# EasyEDA Pro project ProDoc_XC7K35T_GTP_USB_Core_LiteRevB.1.brd_2025-10-08.epro, schematic XC7K35T_GTP_USB_Core_LiteRevB.1.sch

## Sheets
1 FPGA CONFIG: Board Name: XC7K35T_GTP_USB_Core_LiteRevB.brd_1; Create Date: 2025-09-28; Page Name: FPGA CONFIG; Project Name: XC7A35TCSG325_USB3_Demo; Schematic Name: XC7K35T_GTP_USB_Core_LiteRevB.sch_2; Update Date: 2025-09-28; Company: Xxx Studio; Drawed: A.W.2666; Page Size: A3; Reviewed: A.W.2666; Version: Rev.A.0
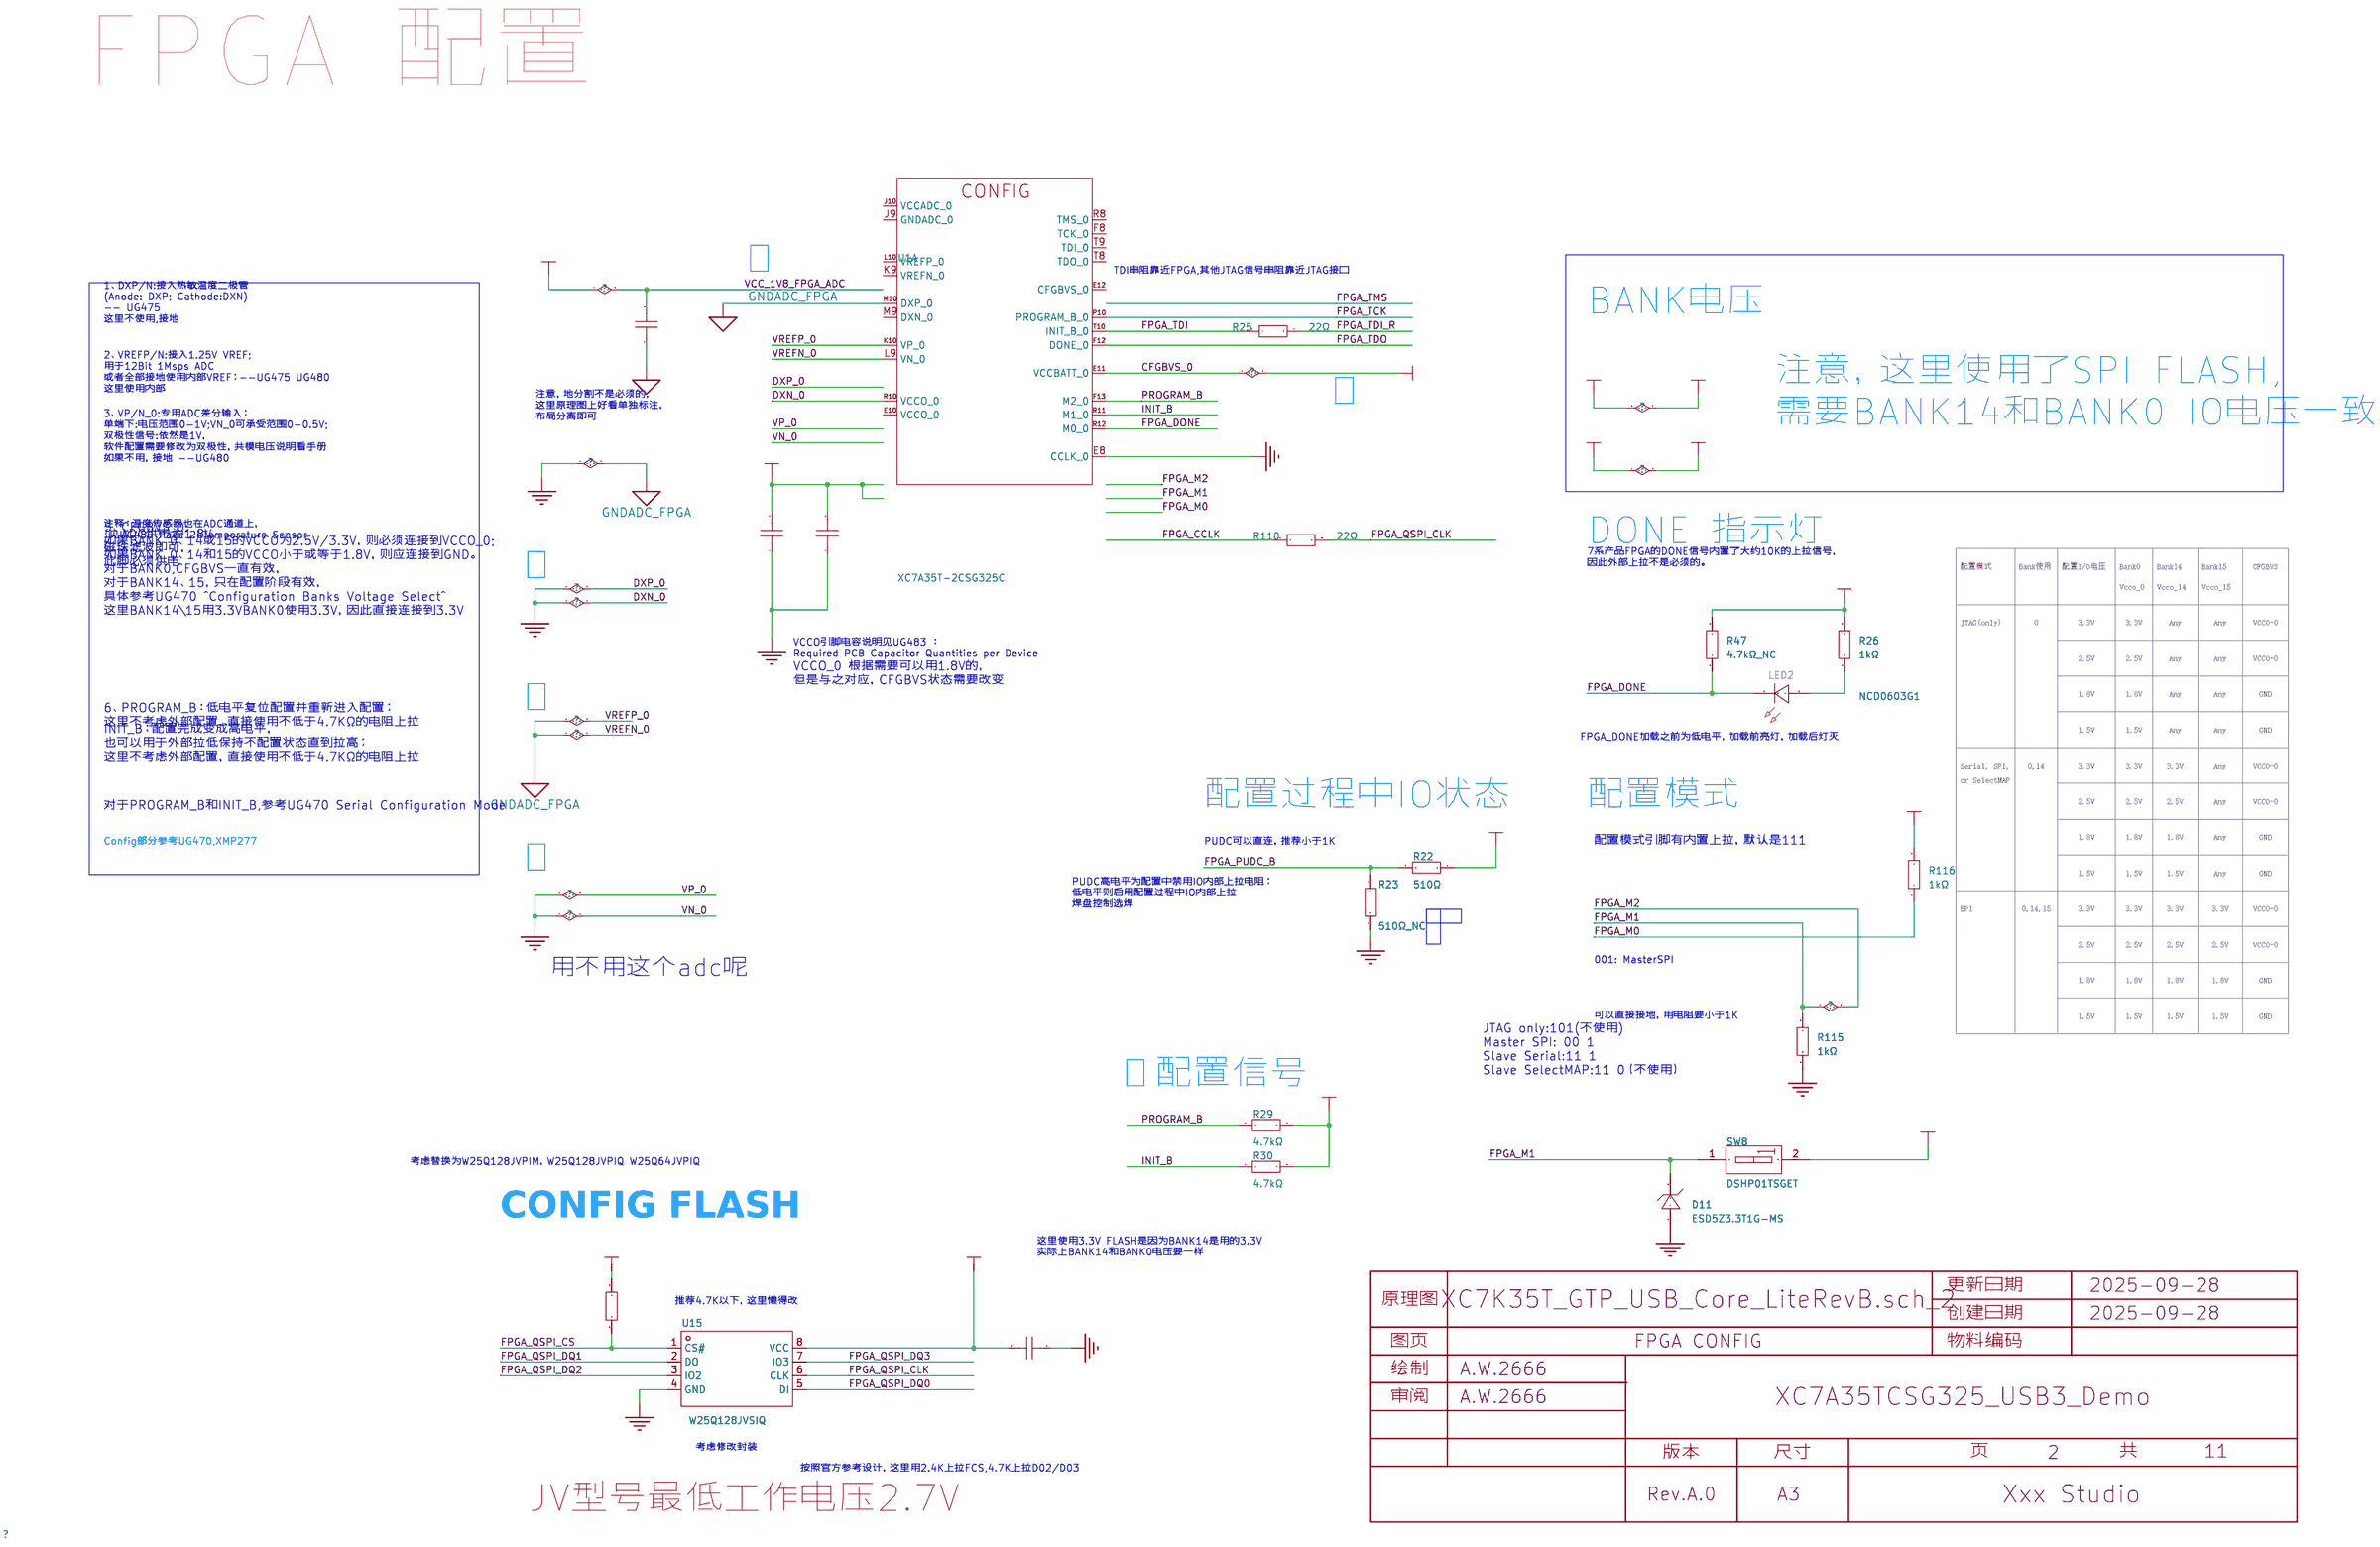
[diagram p0: FPGA CONFIG]
2 BANK14_15_BANK34: Board Name: XC7K35T_GTP_USB_Core_LiteRevB.brd; Create Date: 2025-09-08; Page Name: BANK14_15_BANK34; Schematic Name: XC7K35T_GTP_USB_Core_LiteRevB.sch; Update Date: 2025-09-08
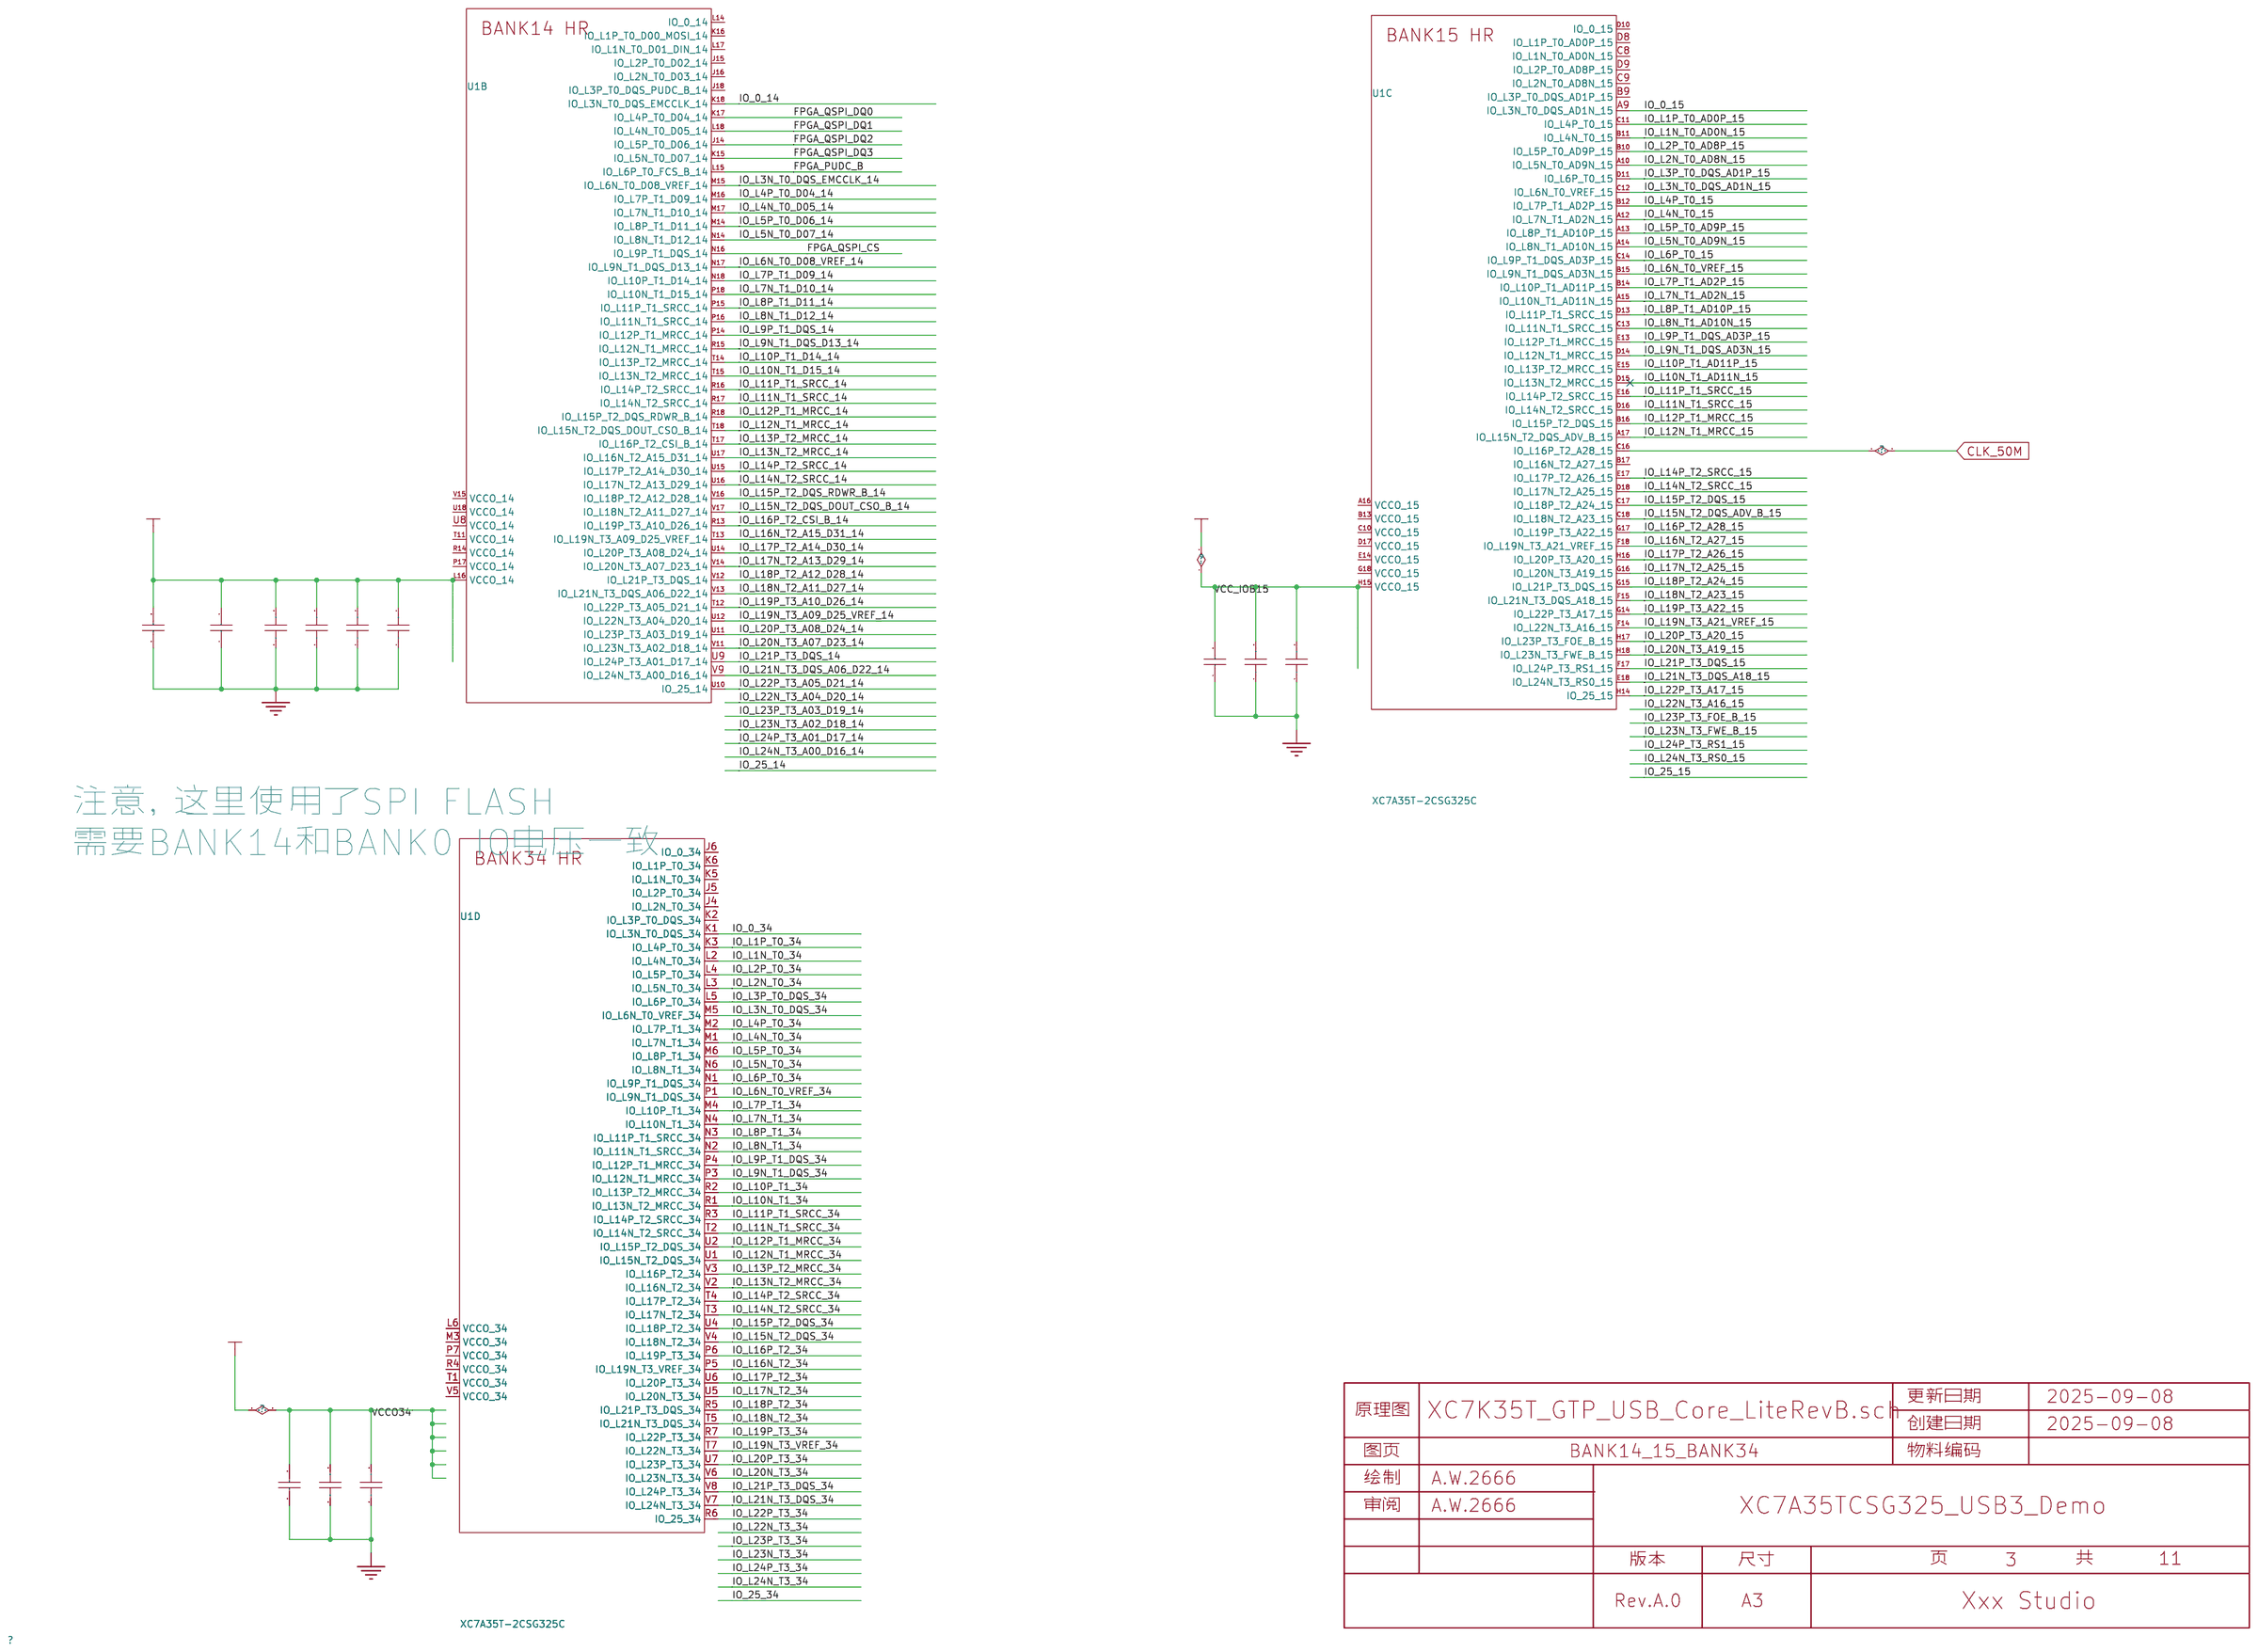
[diagram p1: BANK14_15_BANK34]
3 FPGA POWER: Board Name: XC7K35T_GTP_USB_Core_LiteRevB.brd; Create Date: 2025-09-08; Page Name: FPGA POWER; Schematic Name: XC7K35T_GTP_USB_Core_LiteRevB.sch; Update Date: 2025-09-08
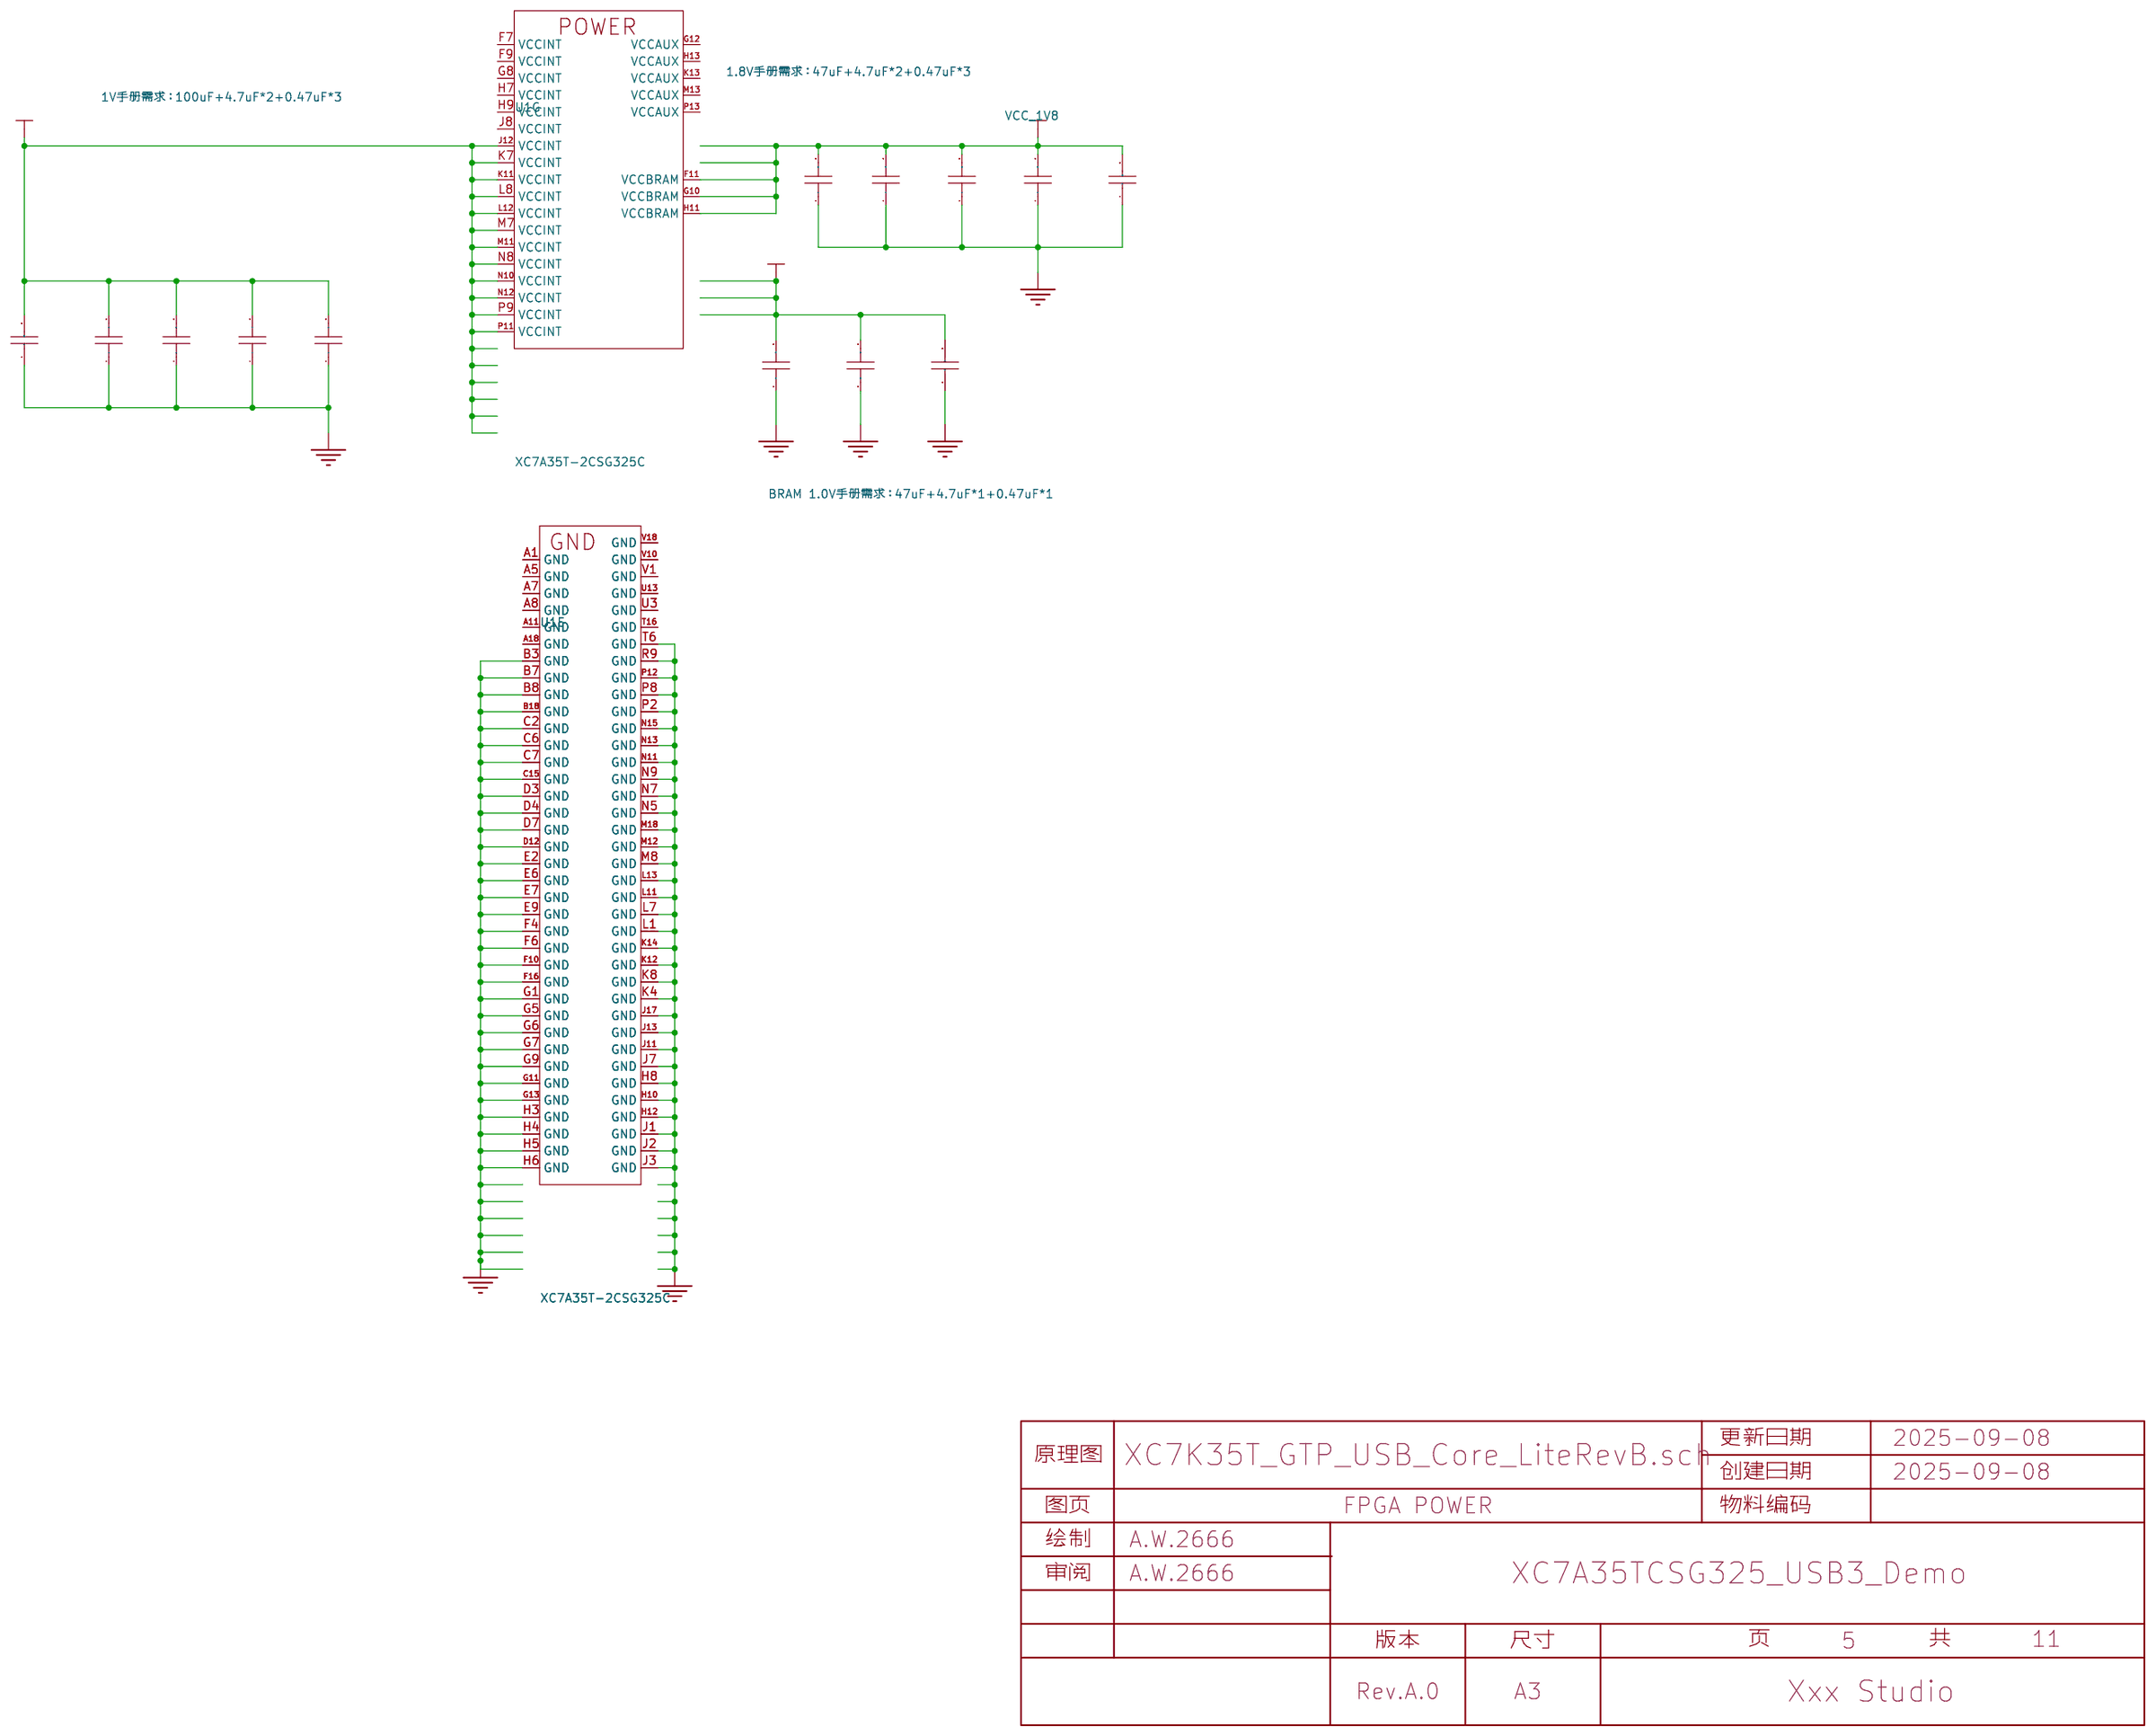
[diagram p2: FPGA POWER]
4 FPGA GTP: Board Name: XC7K35T_GTP_USB_Core_LiteRevB.brd; Create Date: 2025-09-08; Page Name: FPGA GTP; Schematic Name: XC7K35T_GTP_USB_Core_LiteRevB.sch; Update Date: 2025-09-08
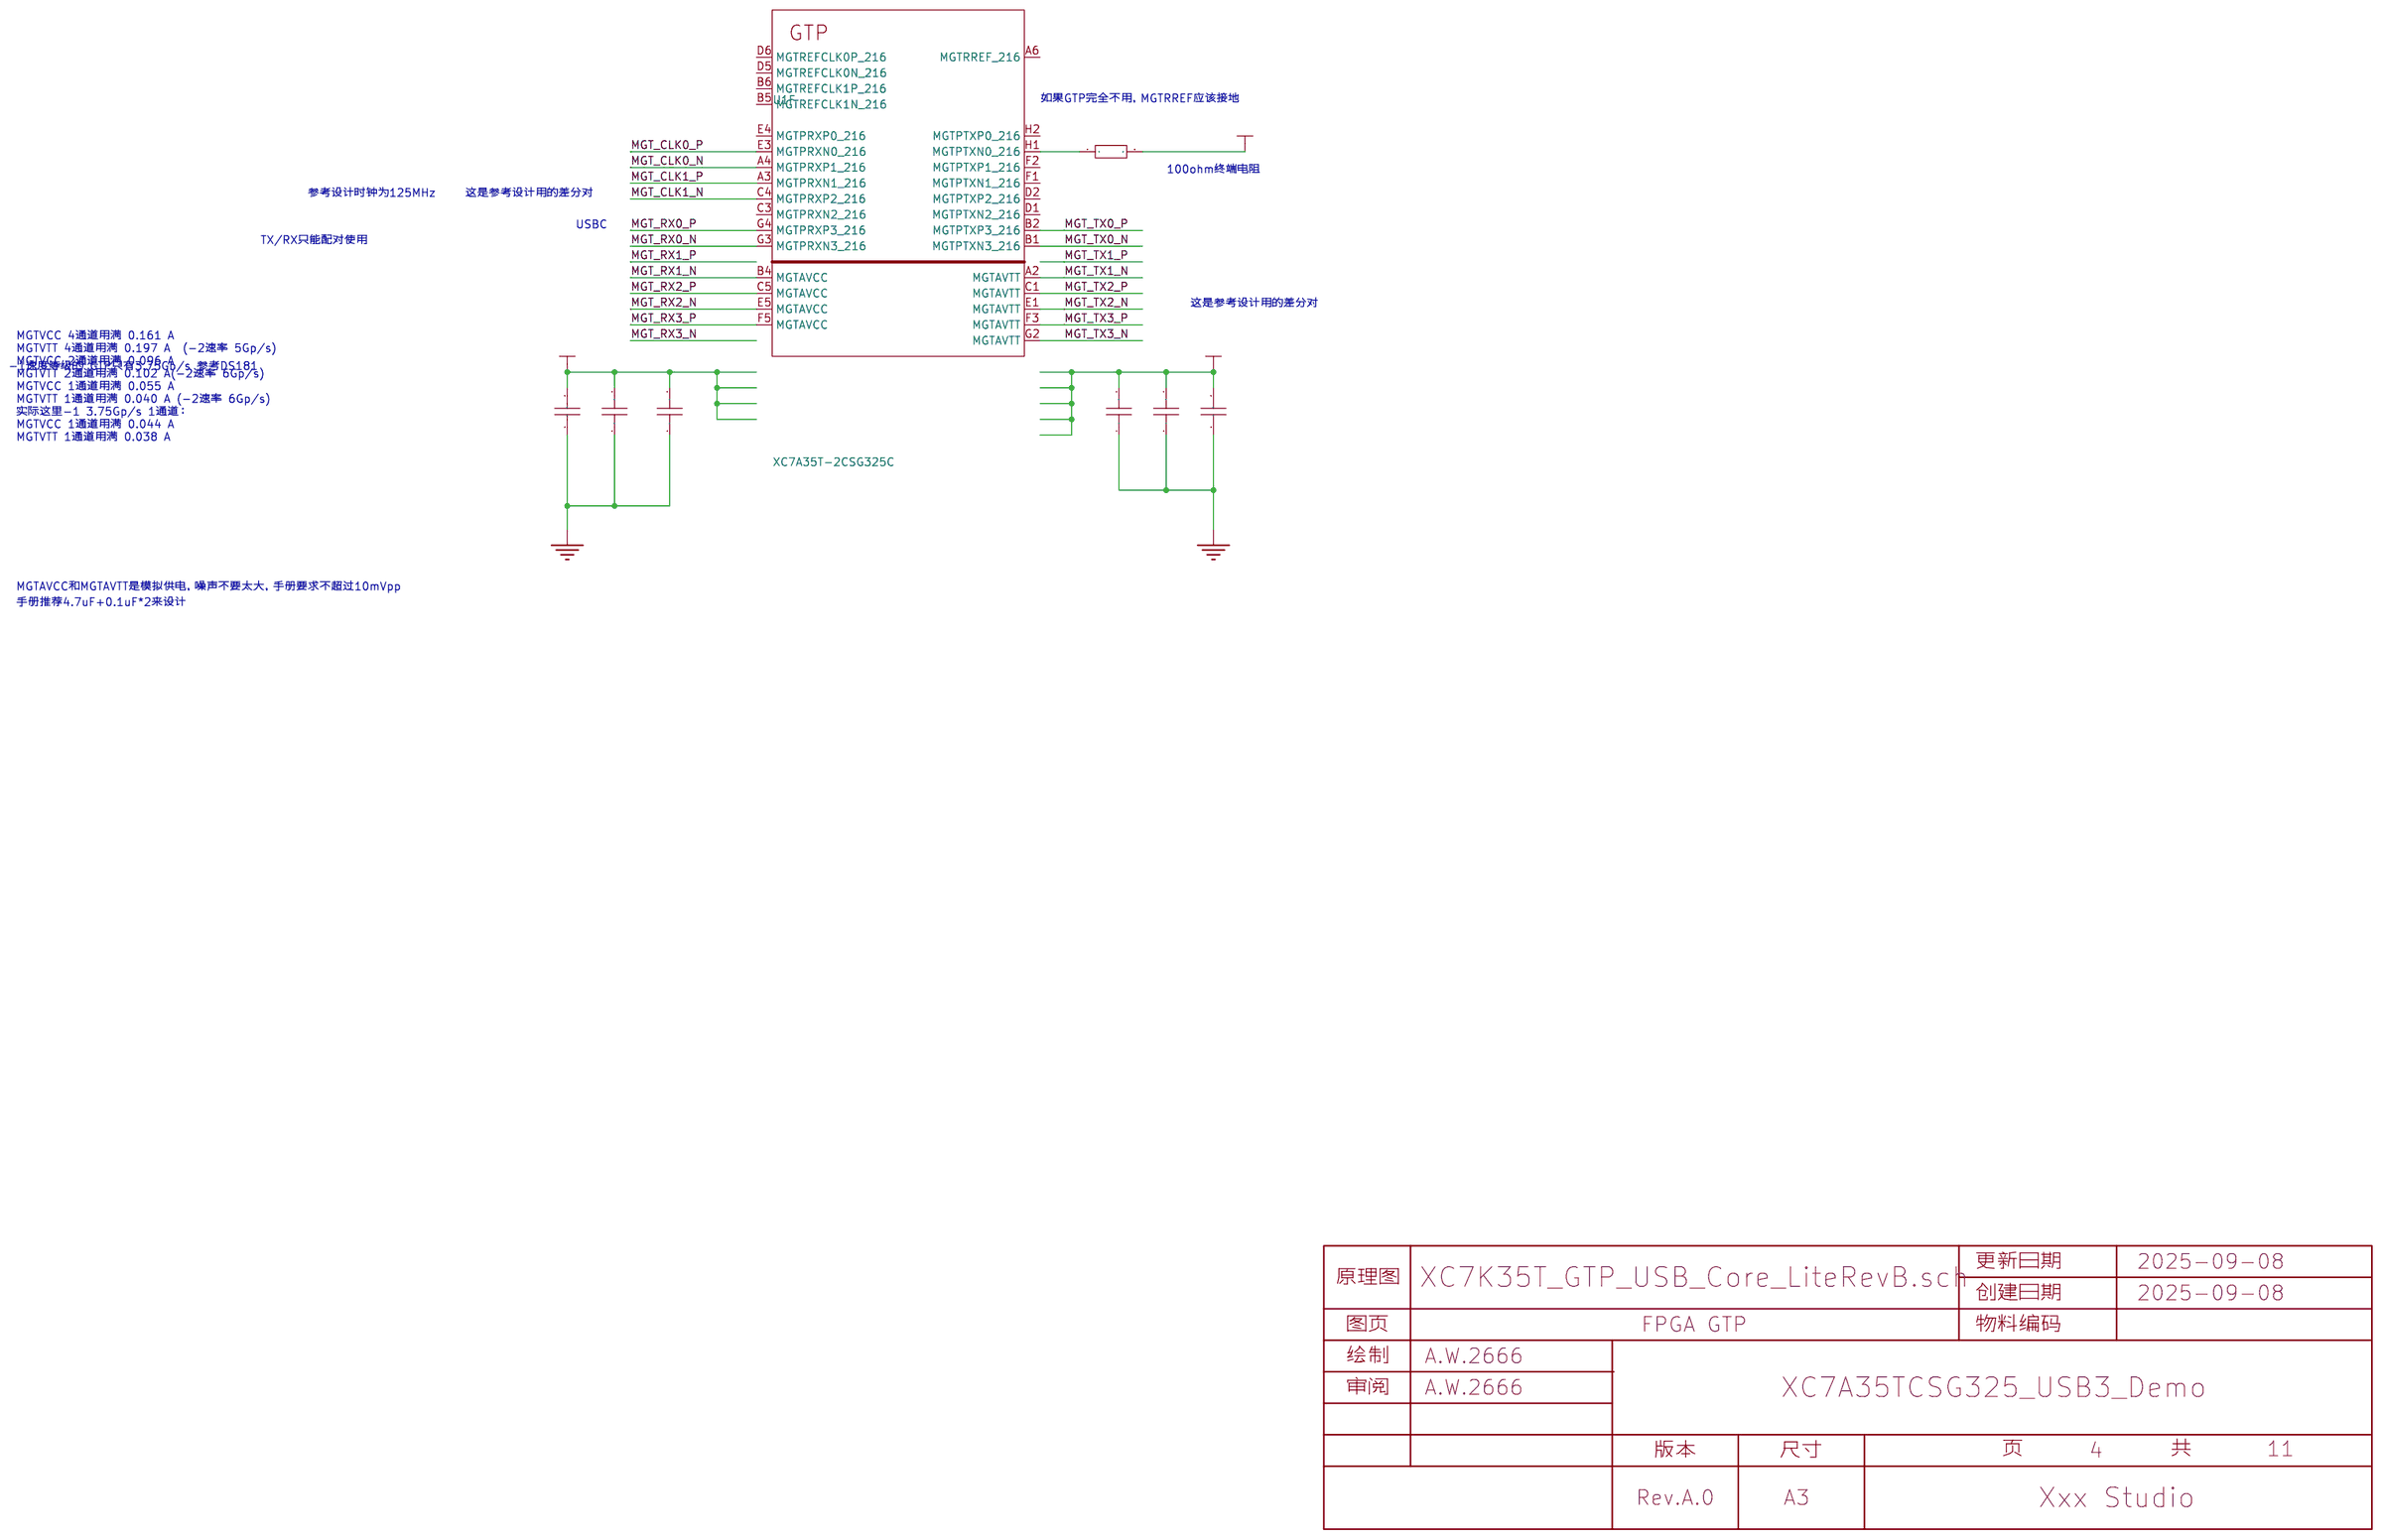
[diagram p3: FPGA GTP]
5 USB&BTB: Board Name: XC7K35T_GTP_USB_Core_LiteRevB.1.brd; Page Name: USB&BTB; Schematic Name: XC7K35T_GTP_USB_Core_LiteRevB.1.sch; Update Date: 2025-10-05
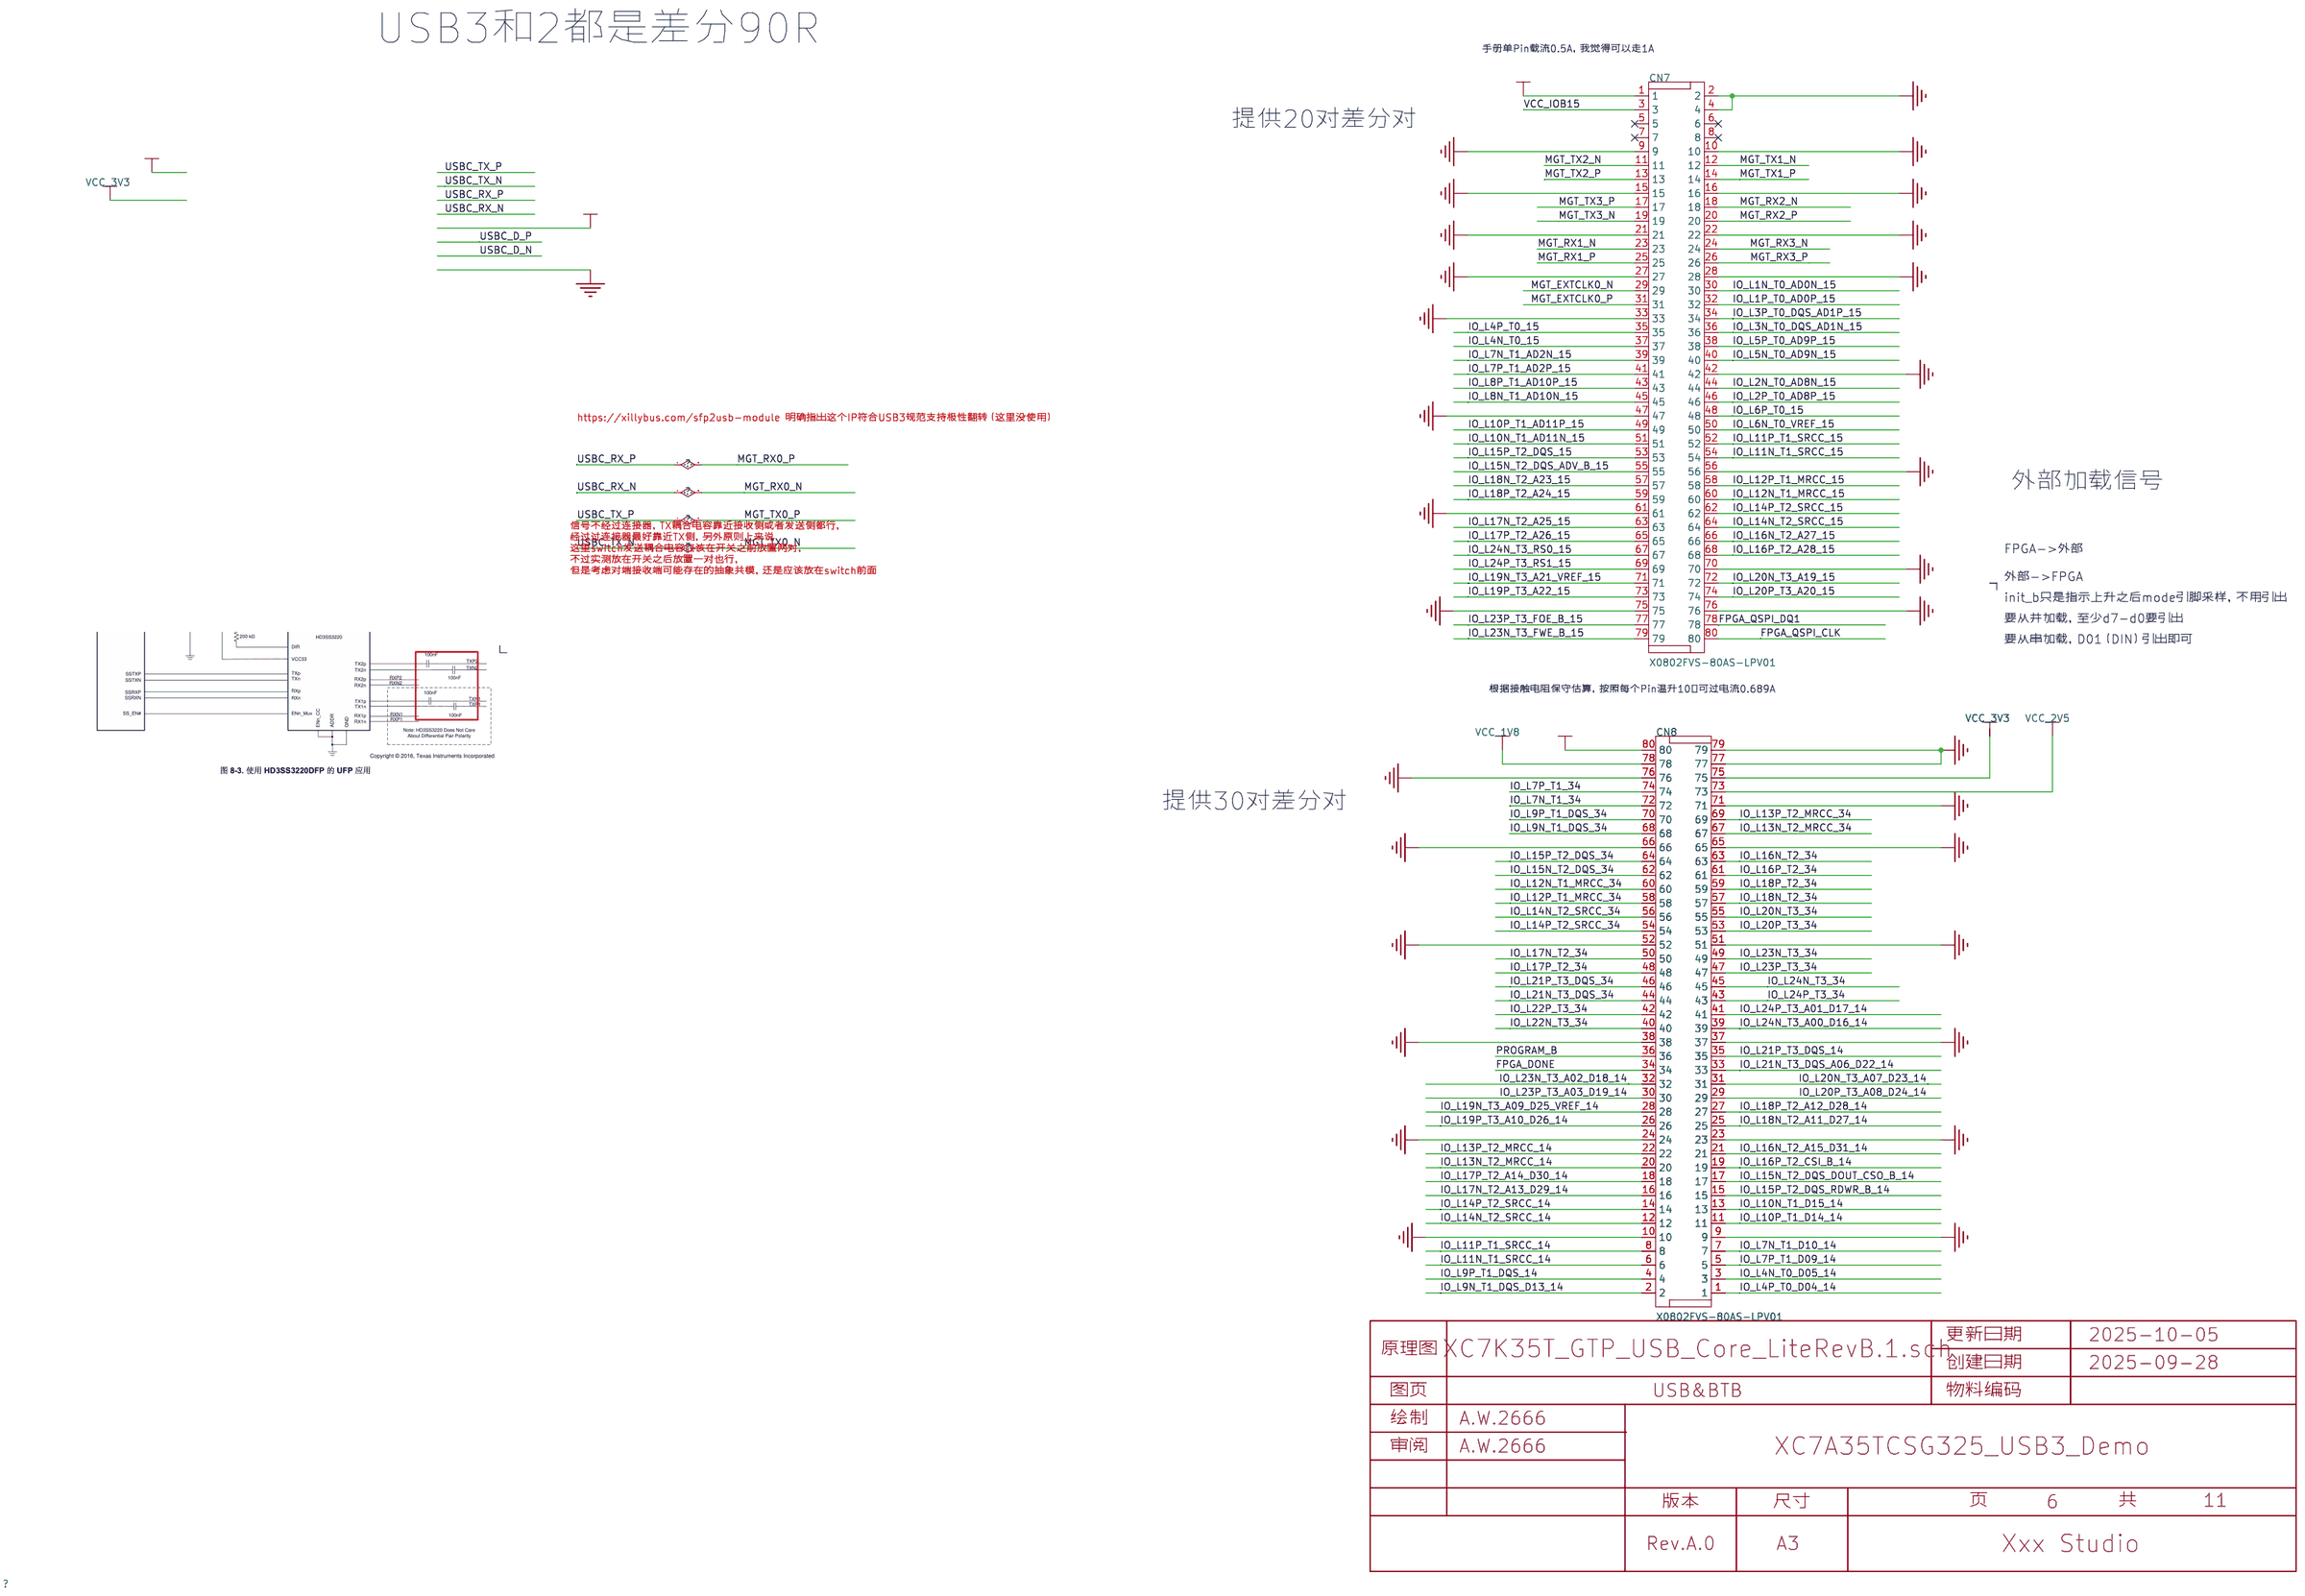
[diagram p4: USB&BTB]
6 CLOCK: Board Name: XC7K35T_GTP_USB_Core_LiteRevB.brd; Create Date: 2025-09-08; Page Name: CLOCK; Schematic Name: XC7K35T_GTP_USB_Core_LiteRevB.sch; Update Date: 2025-09-10
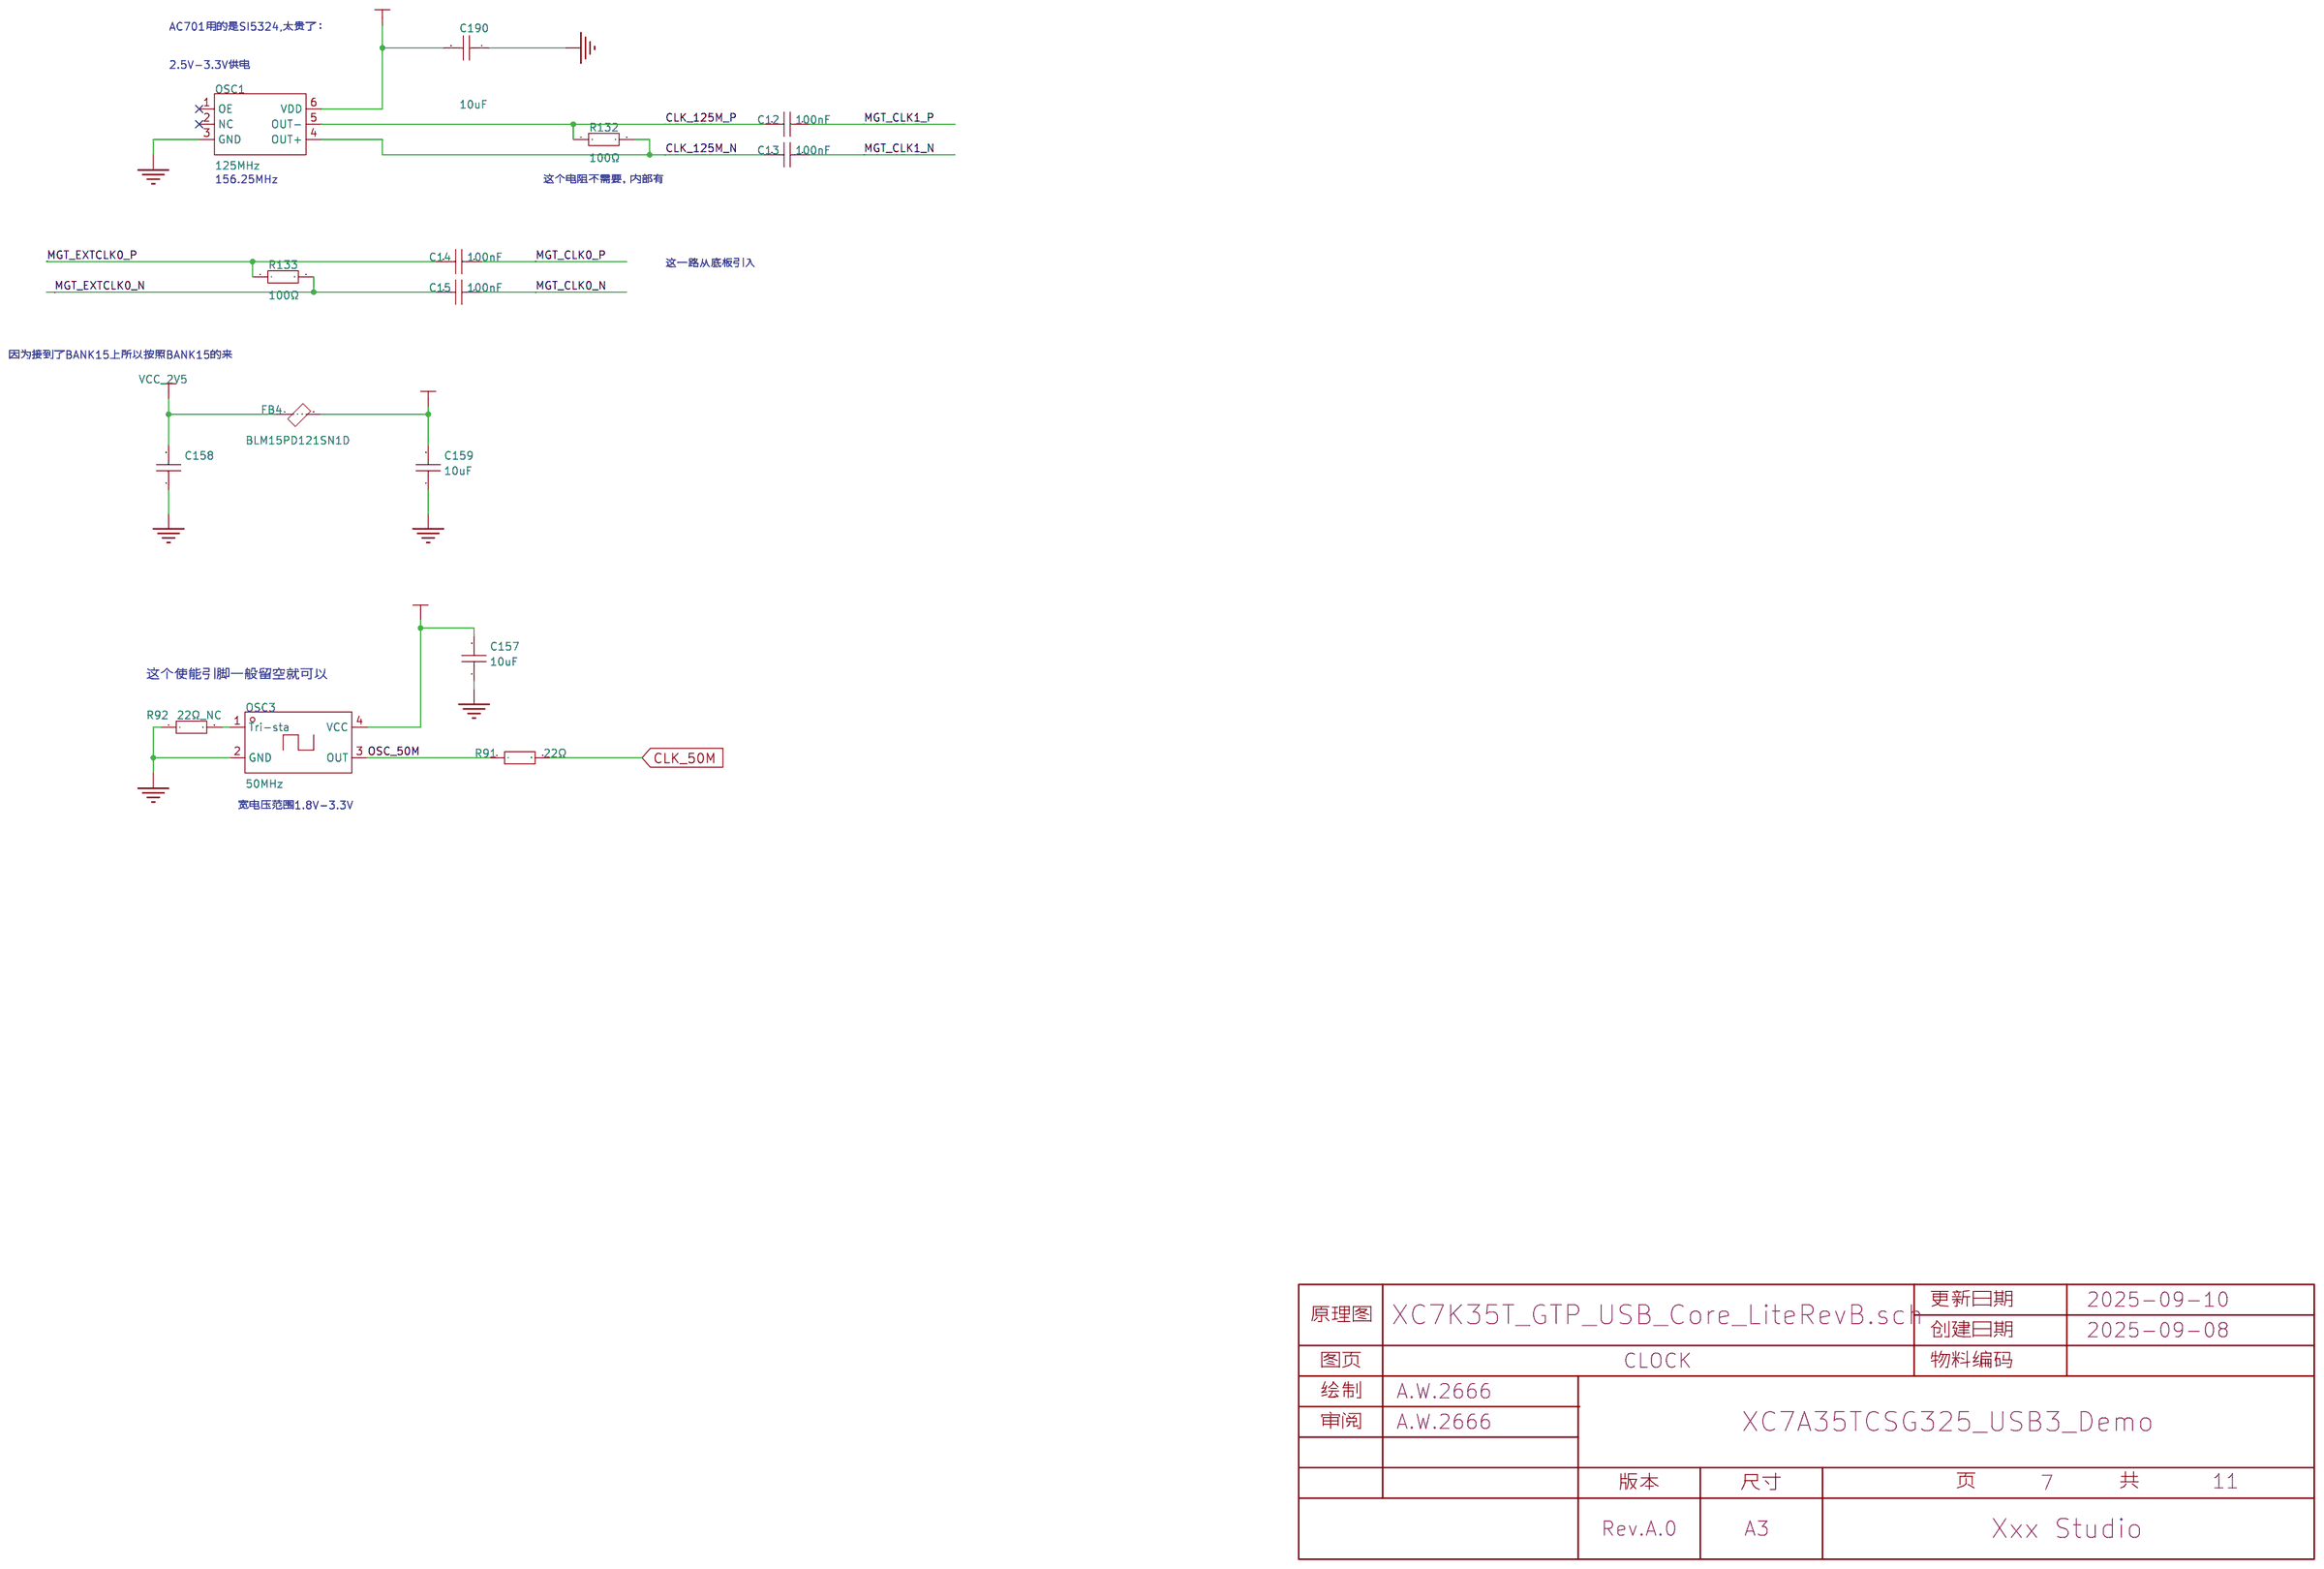
[diagram p5: CLOCK]
7 封面: Board Name: XC7K35T_GTP_USB_Core_LiteRevB.1.brd; Page Name: 封面; Schematic Name: XC7K35T_GTP_USB_Core_LiteRevB.1.sch
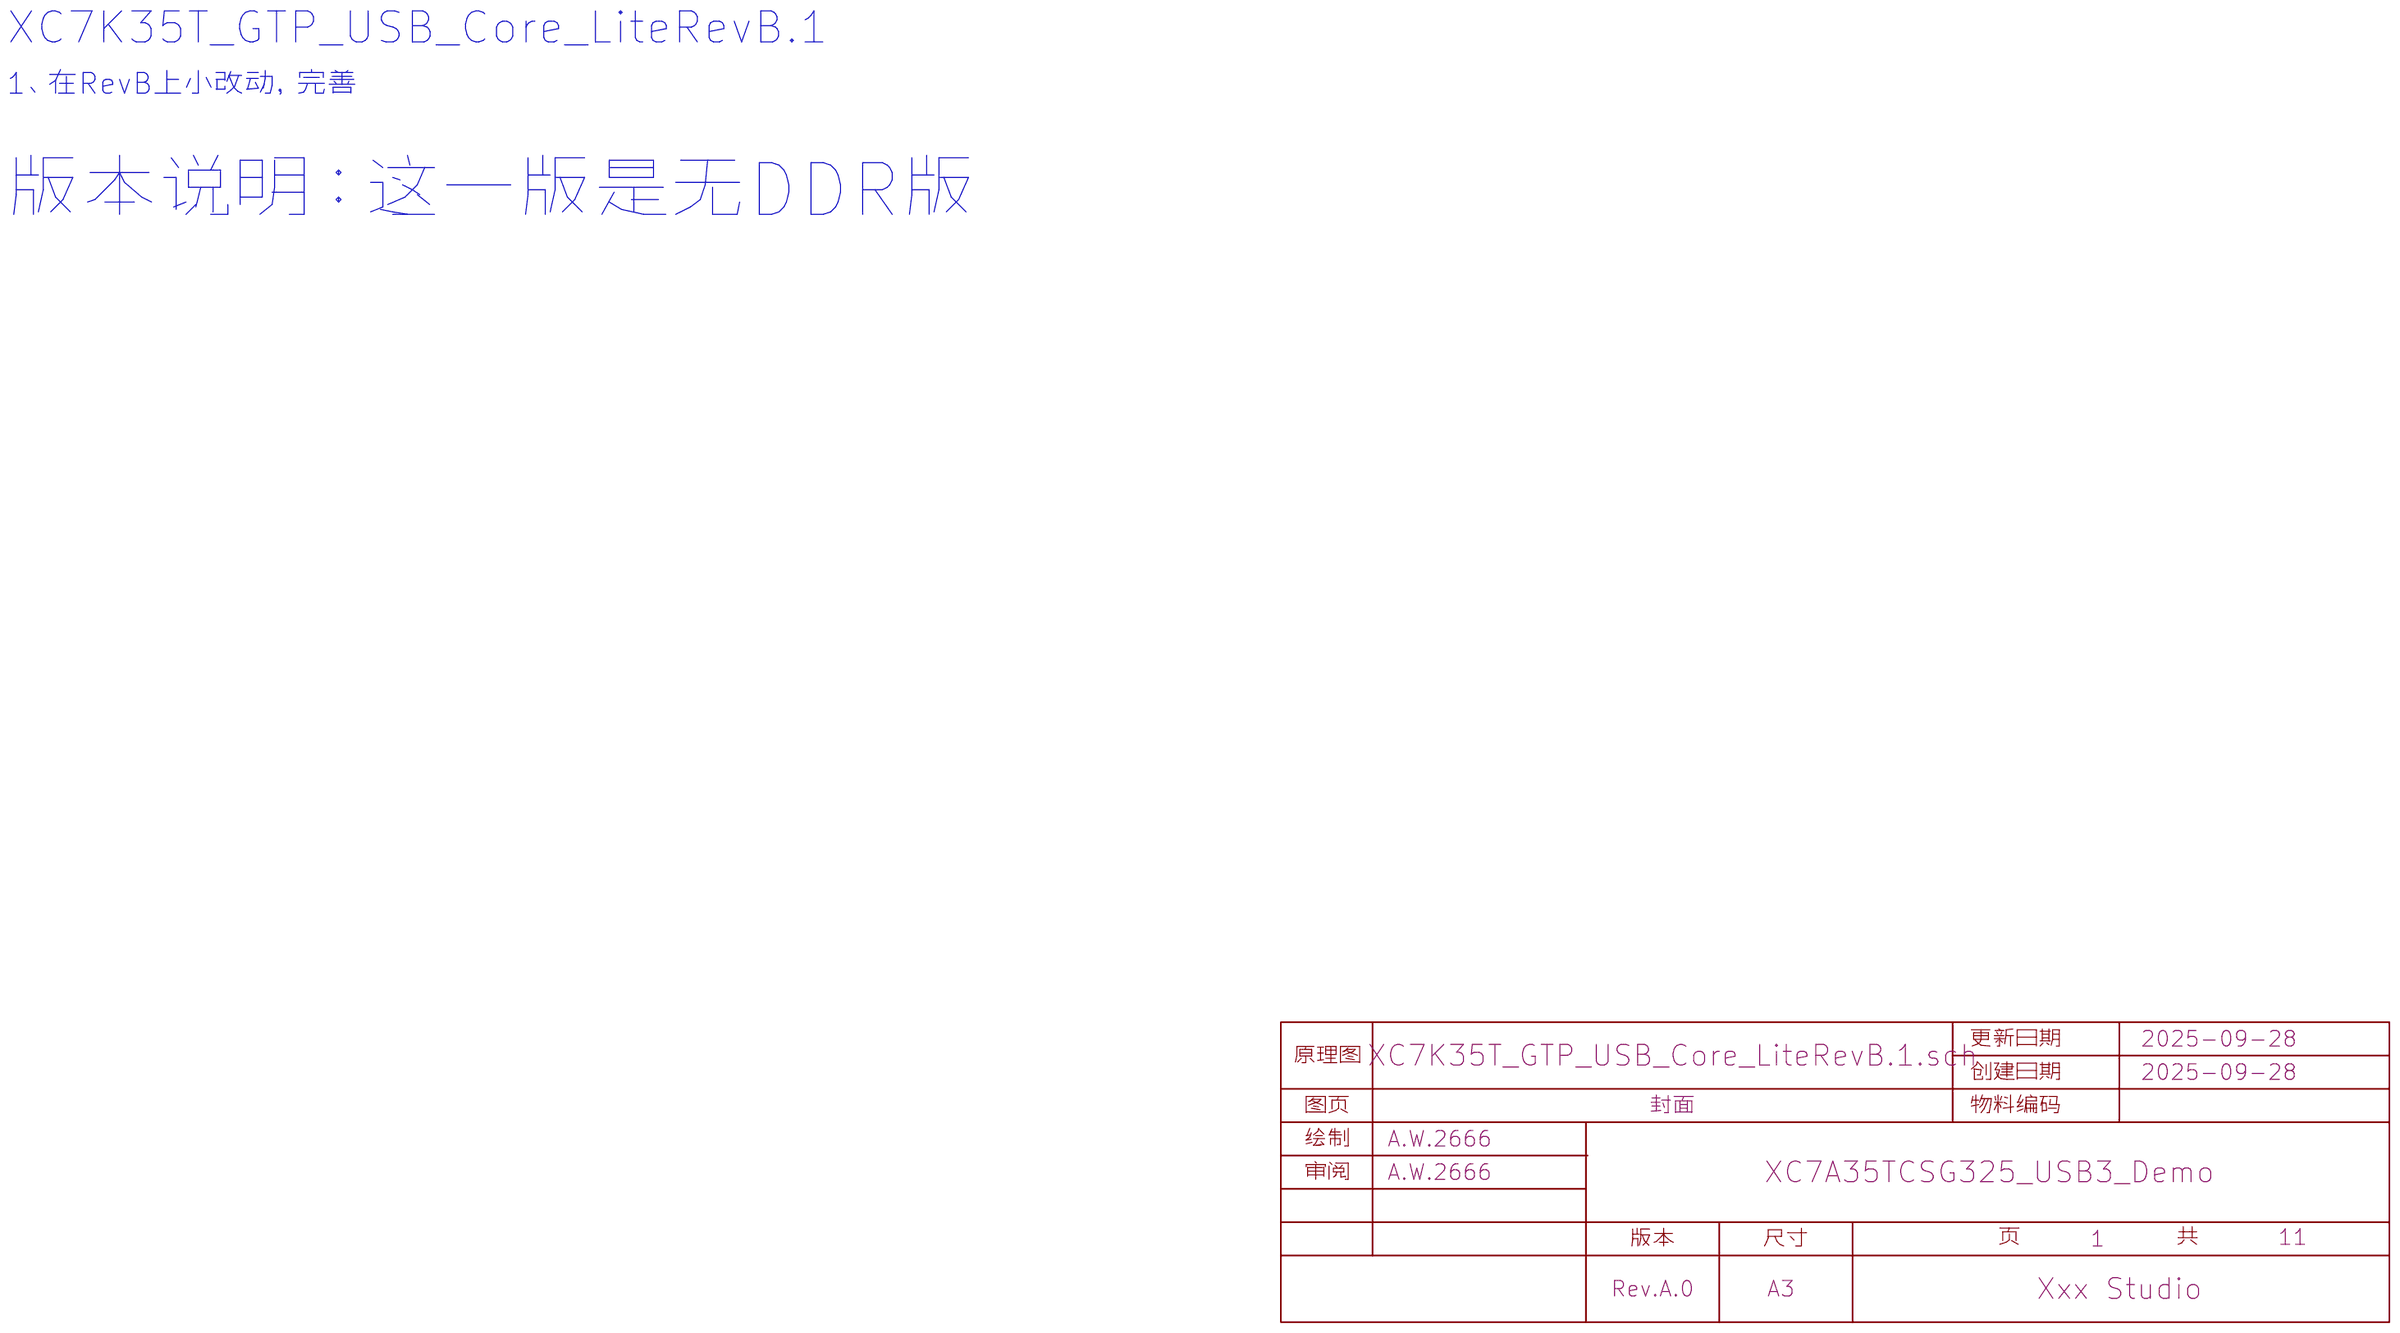
[diagram p6: 封面]
8 Mech&Conn: Board Name: XC7K35T_GTP_USB_Core_LiteRevB.1.brd; Page Name: Mech&Conn; Schematic Name: XC7K35T_GTP_USB_Core_LiteRevB.1.sch; Update Date: 2025-10-05
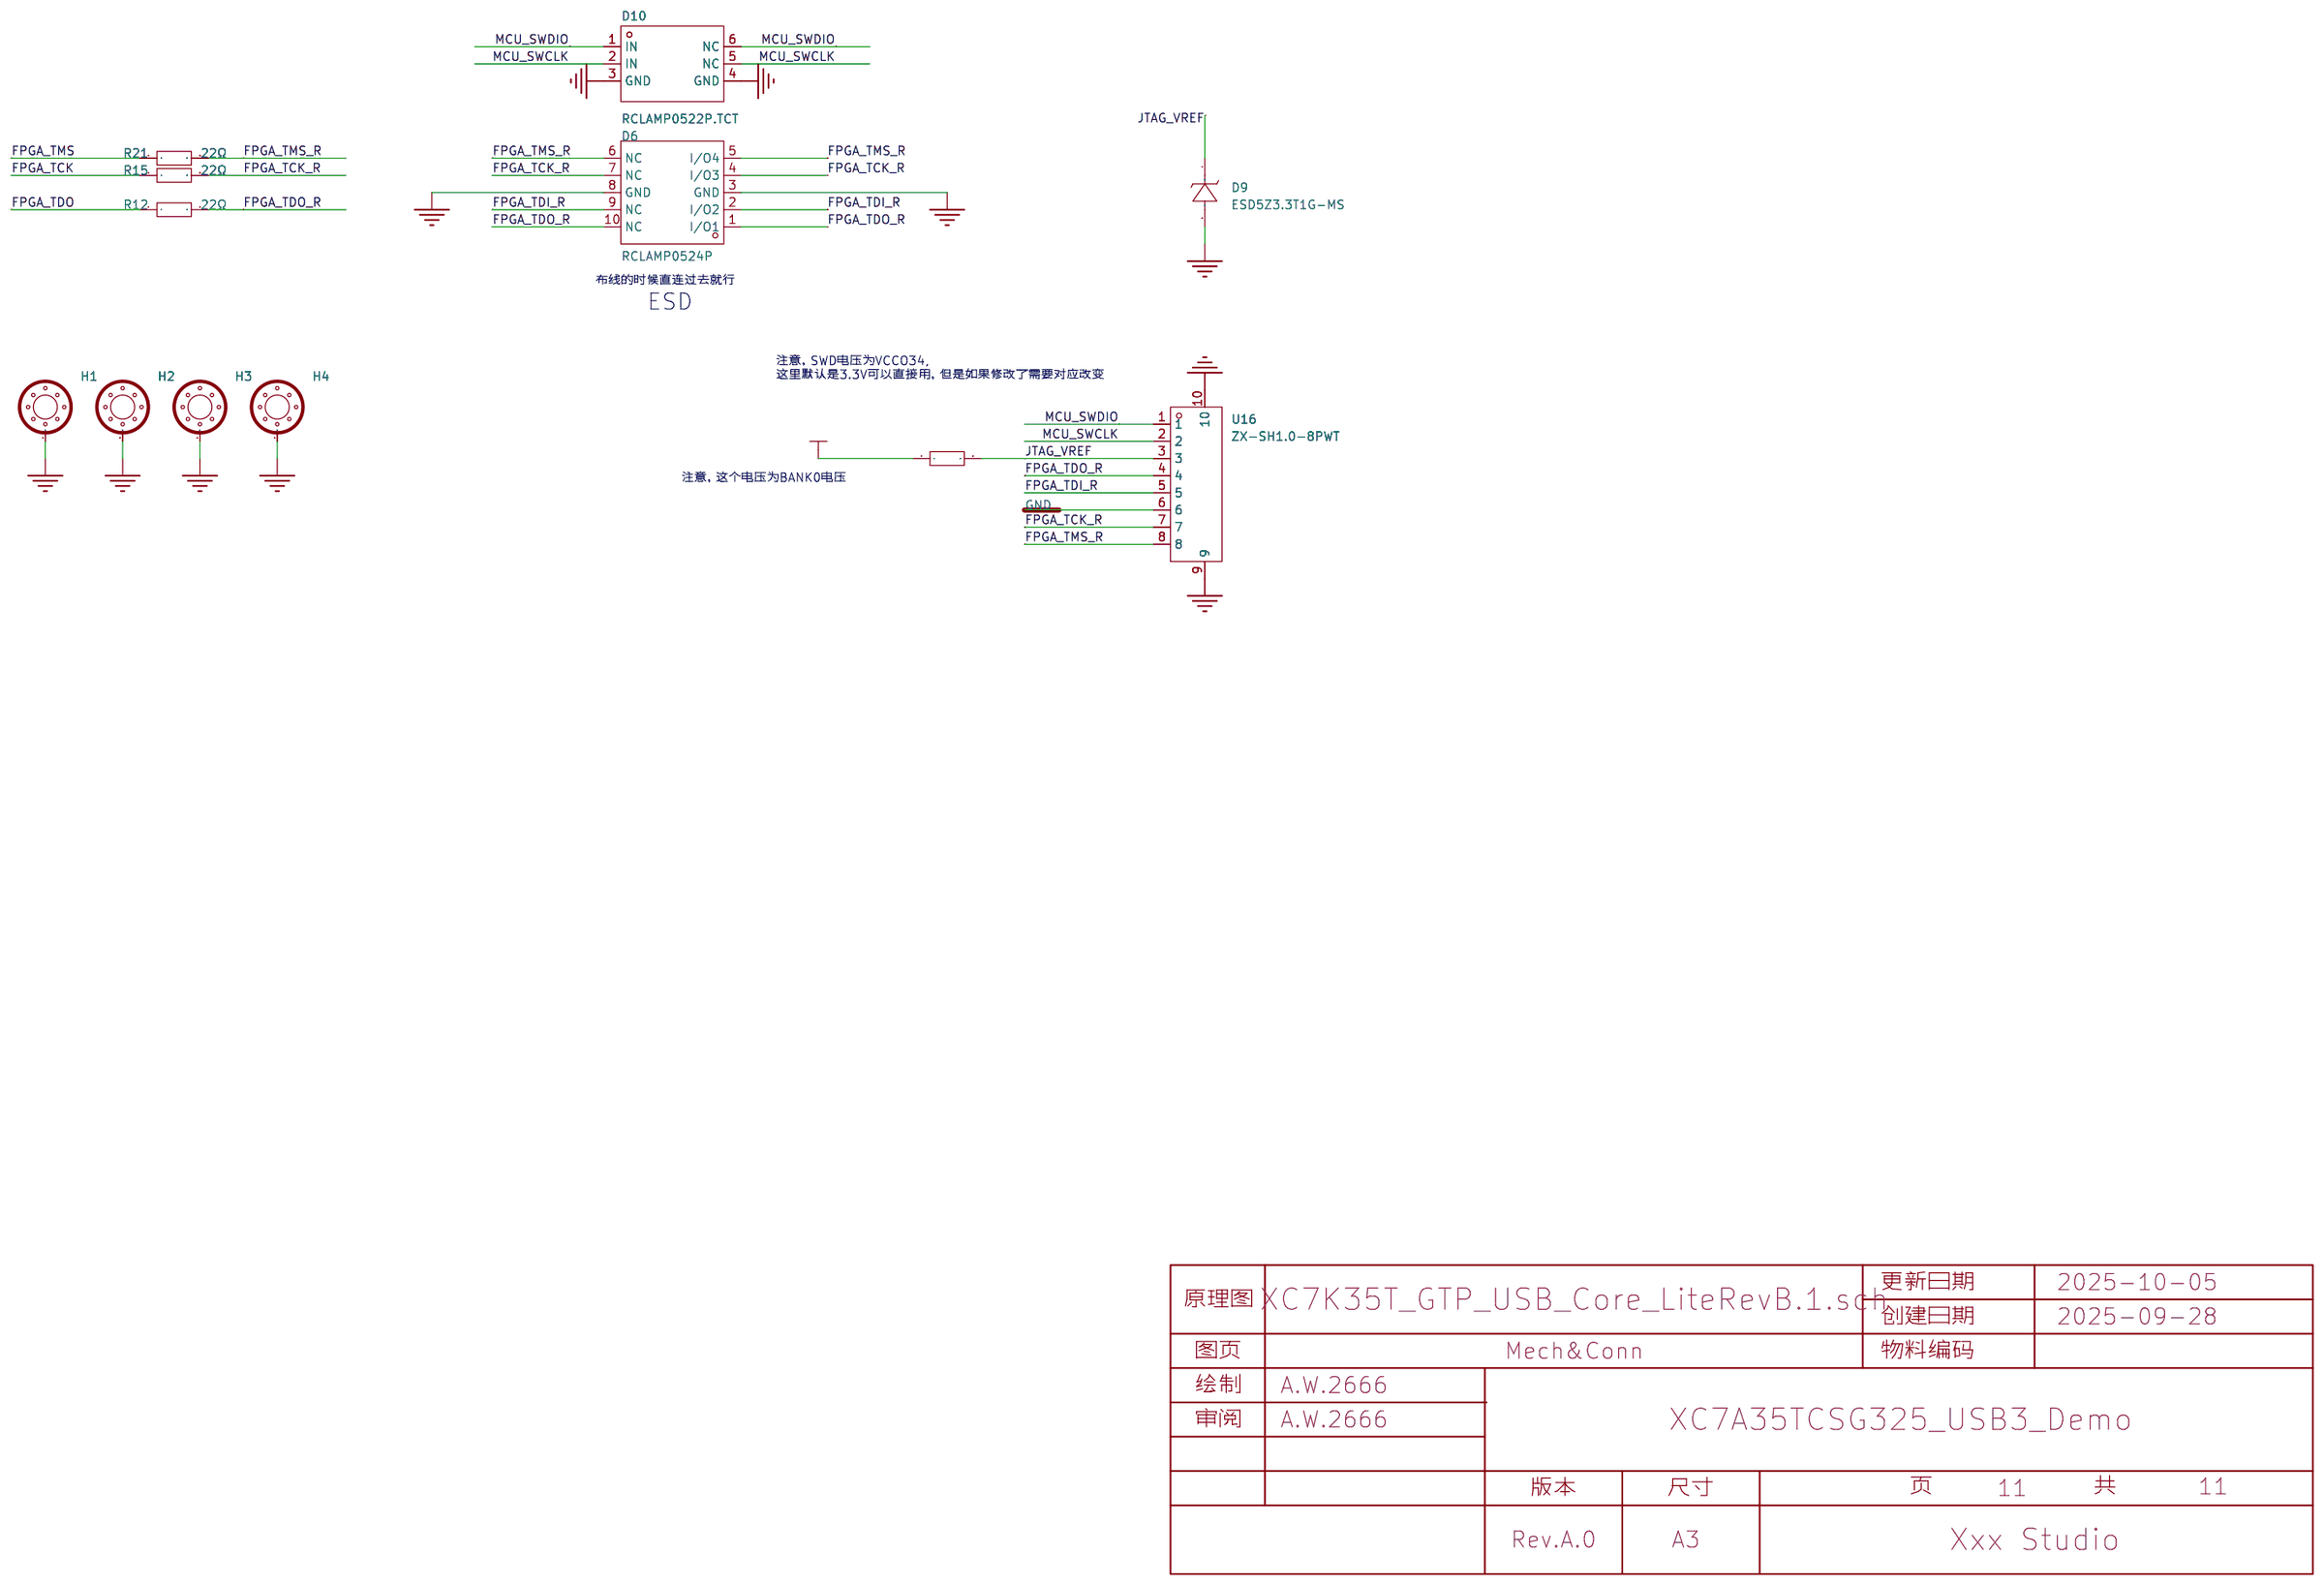
[diagram p7: Mech&Conn]
9 SYS_POWER: Board Name: XC7K35T_GTP_USB_Core_LiteRevB.1.brd; Page Name: SYS_POWER; Schematic Name: XC7K35T_GTP_USB_Core_LiteRevB.1.sch; Update Date: 2025-10-05
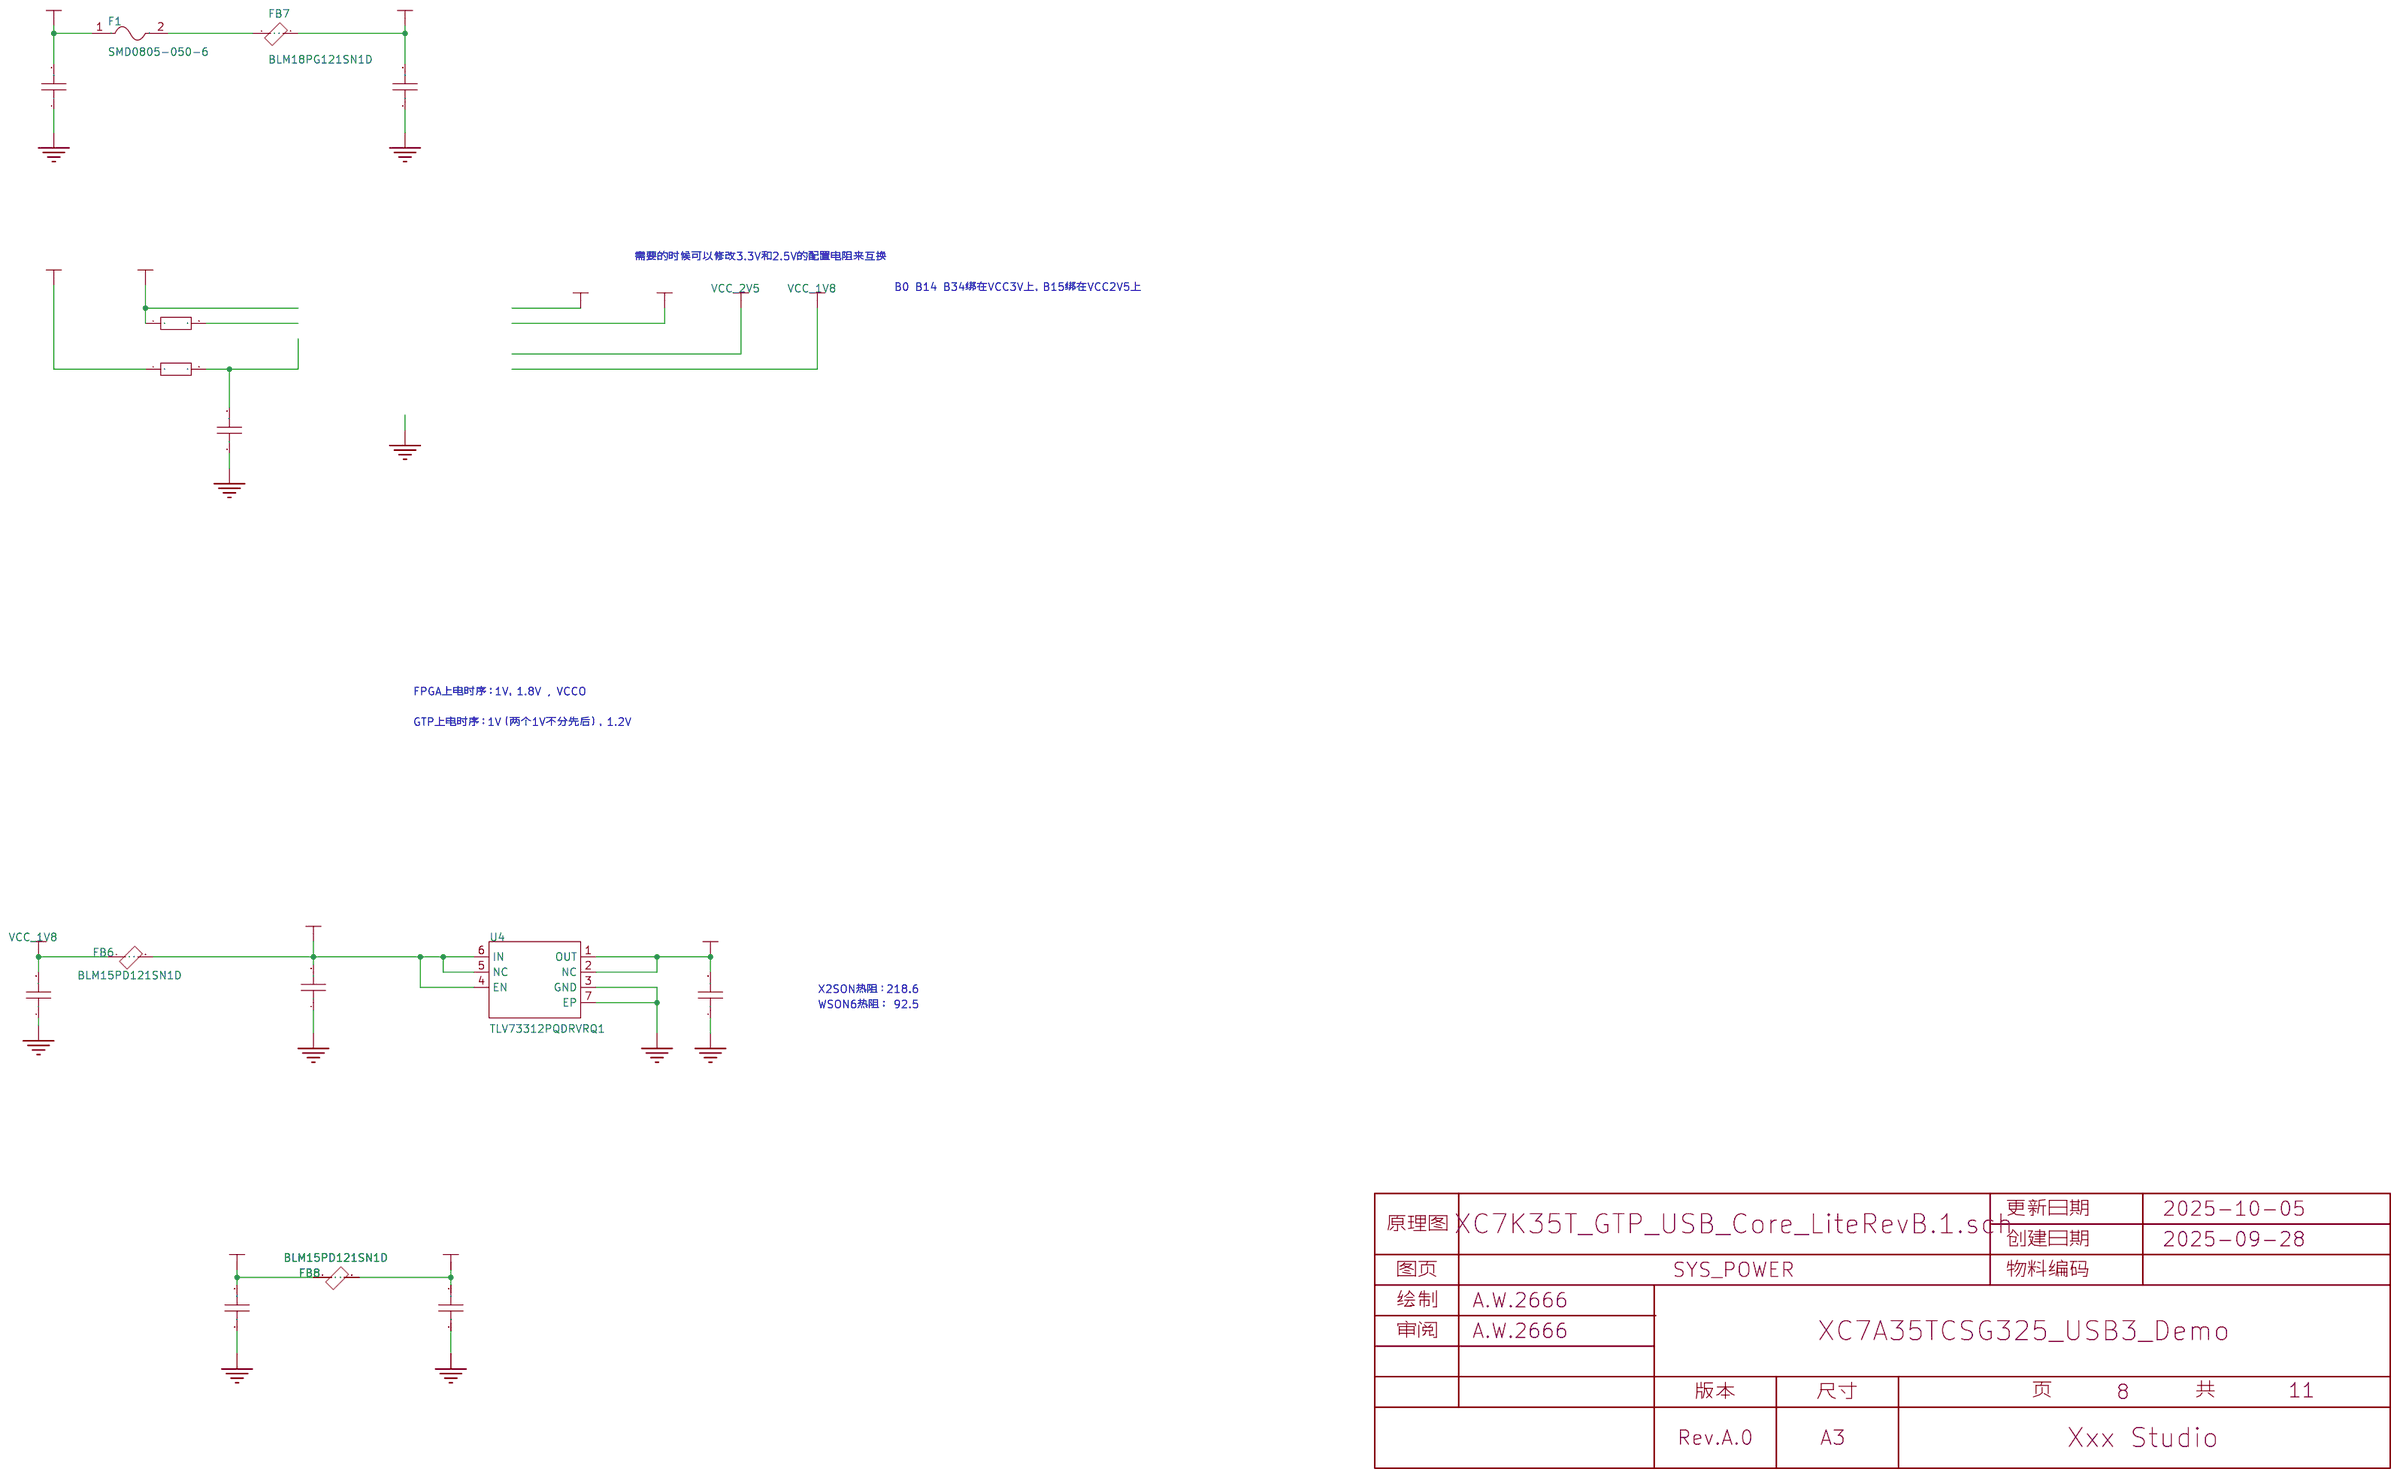
[diagram p8: SYS_POWER]
10 LED&BTN: Page Name: LED&BTN
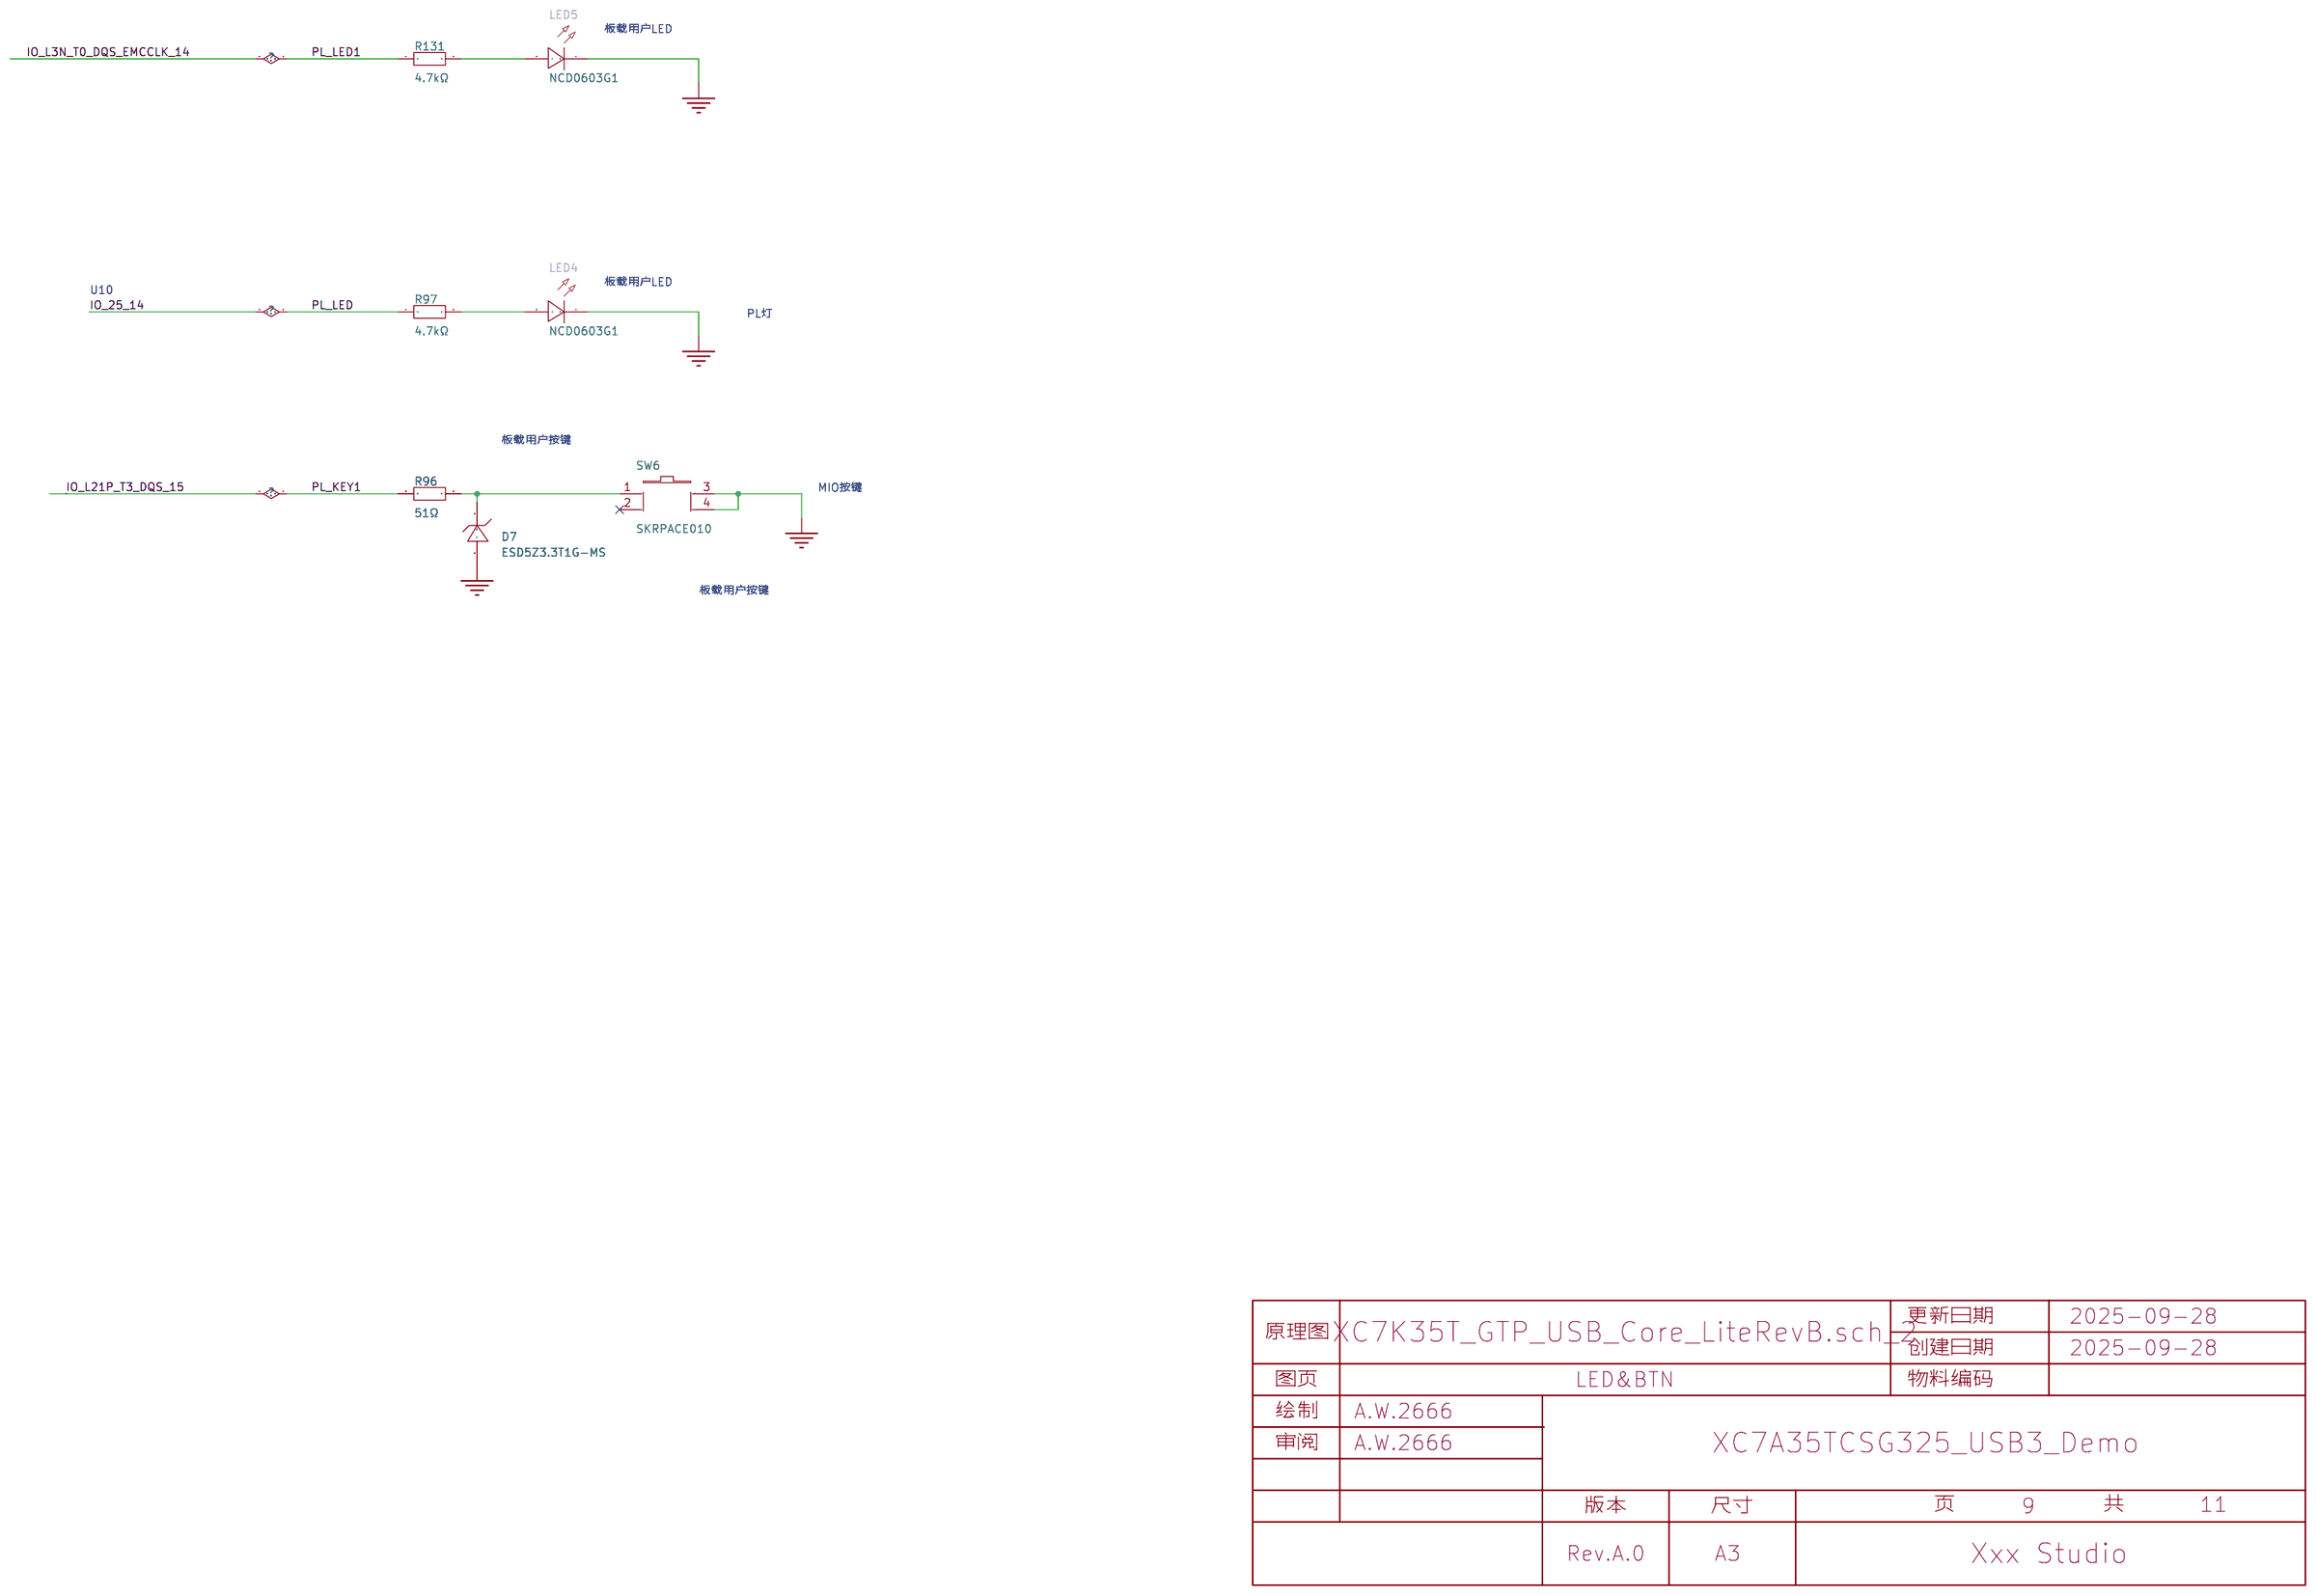
[diagram p9: LED&BTN]
11 MCU(JTAG): Page Name: MCU(JTAG); Update Date: 2025-10-05
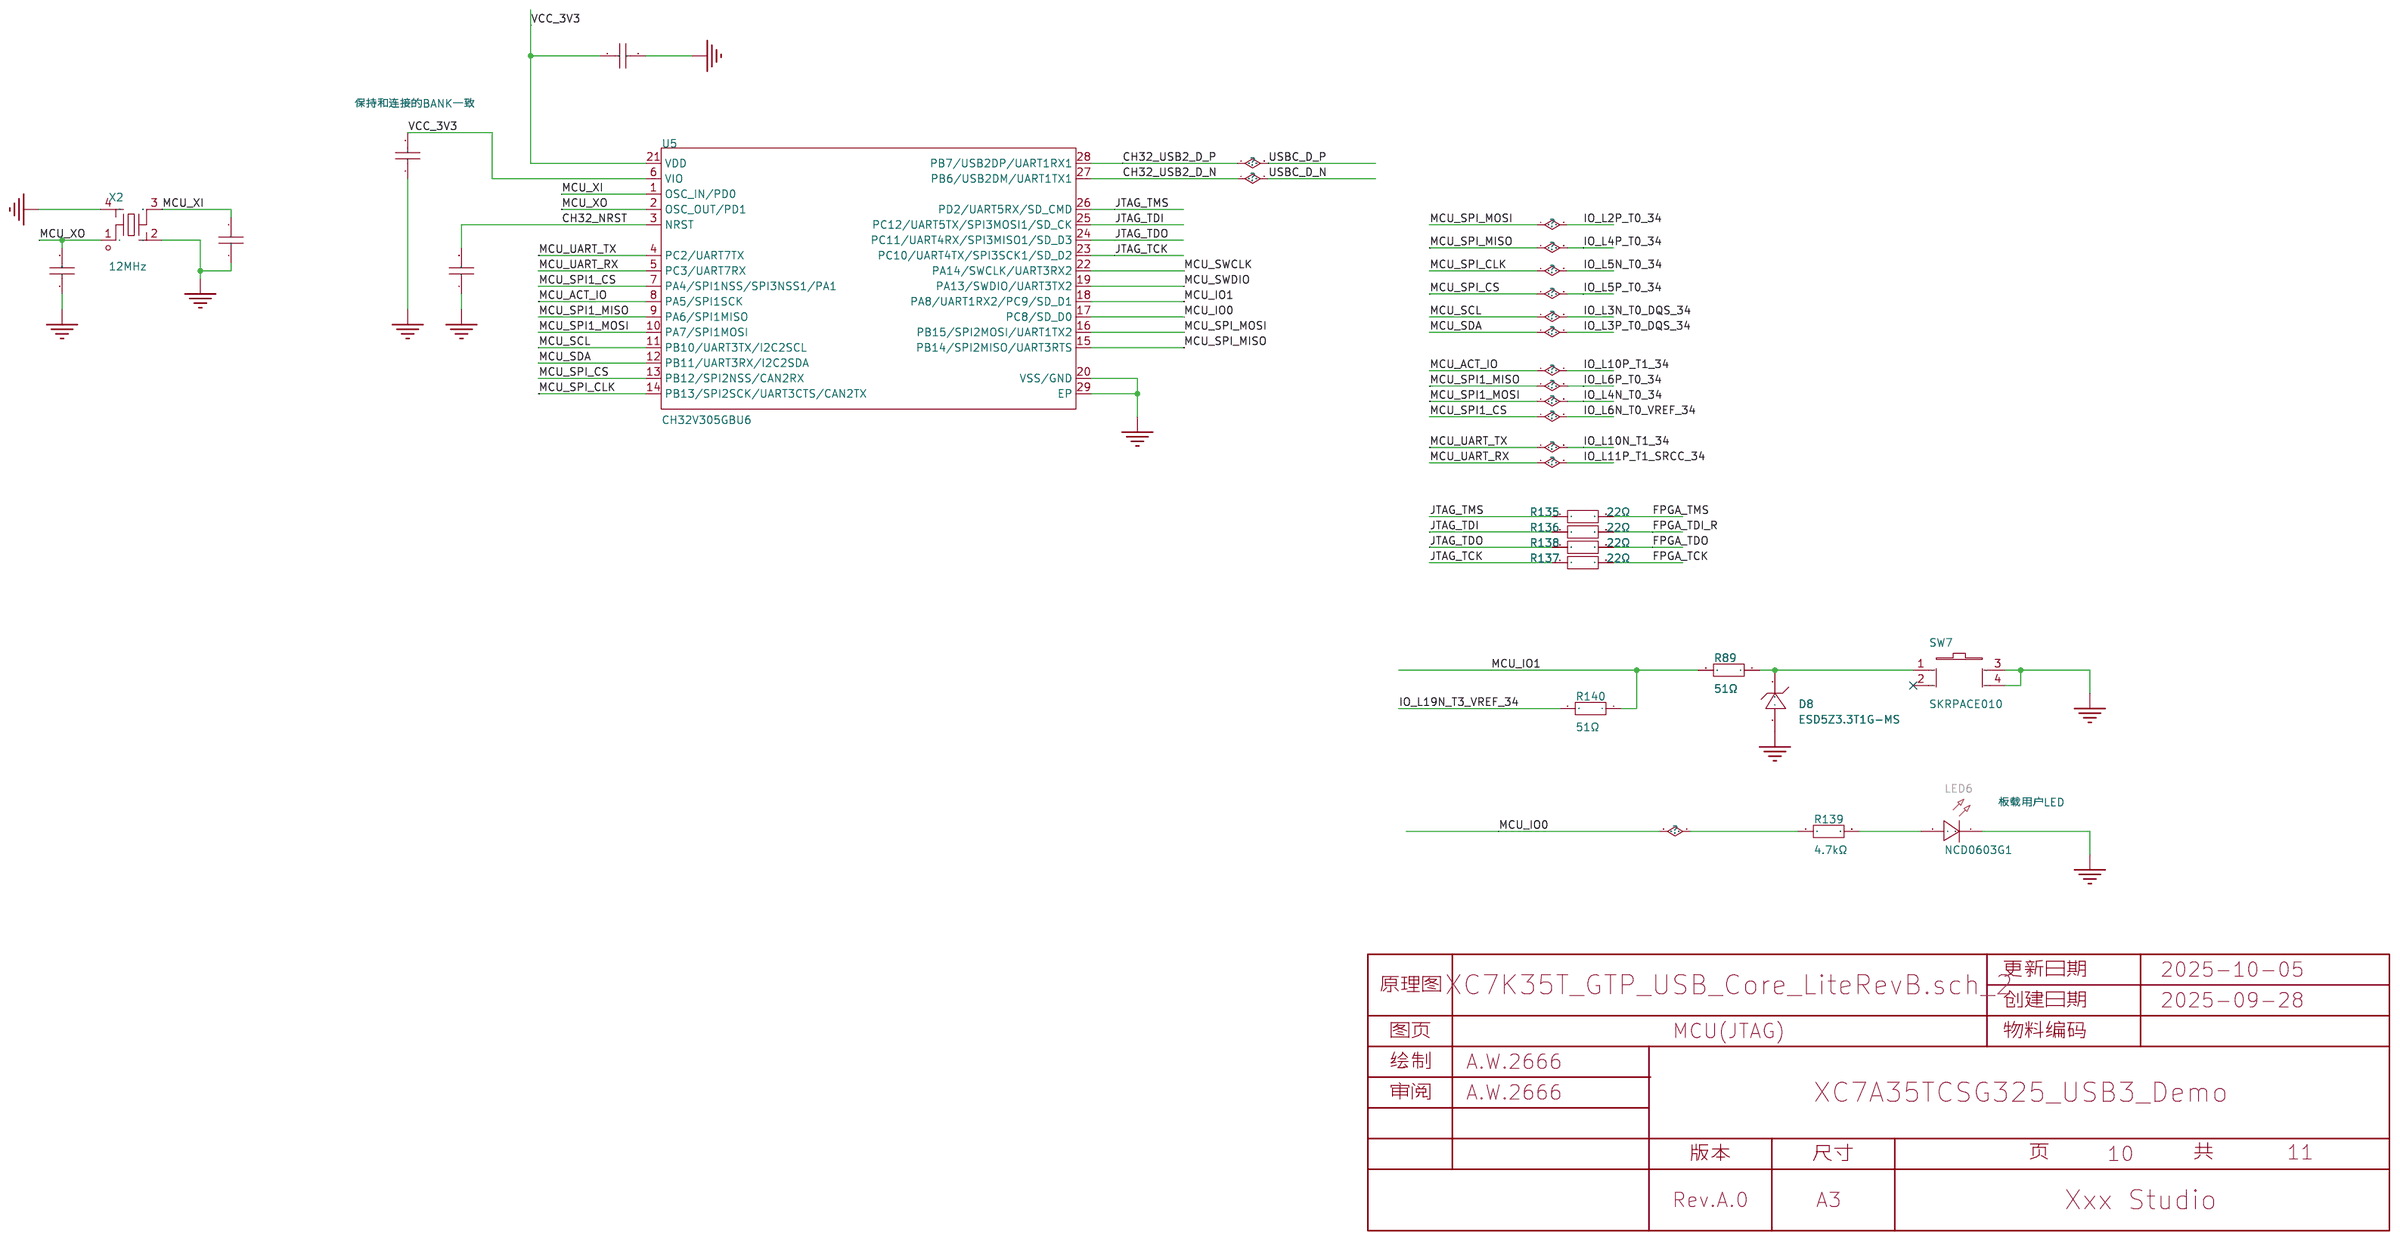
[diagram p10: MCU(JTAG)]

## Parts
sheet BANK14_15_BANK34
C161  470nF  [C0402_1005M_BGA]
C162  470nF  [C0402_1005M_BGA]
C163  470nF  [C0402_1005M_BGA]
C164  470nF  [C0402_1005M_BGA]
C165  4.7uF  [C0603_1608M]
C166  4.7uF  [C0603_1608M]
C177  470nF  [C0402_1005M_BGA]
C178  470nF  [C0402_1005M_BGA]
C179  4.7uF  [C0603_1608M]
C180  470nF  [C0402_1005M_BGA]
C181  470nF  [C0402_1005M_BGA]
C182  4.7uF  [C0603_1608M]
sheet CLOCK
C12  100nF  [C0402_1005M_S]
C13  100nF  [C0402_1005M_S]
C14  100nF  [C0402_1005M_S]
C15  100nF  [C0402_1005M_S]
C157  10uF  [C0402_1005M_S]  (no BOM)
C158  10uF  [C0402_1005M_S]
C159  10uF  [C0402_1005M_S]
C190  10uF  [C0402_1005M_S]
FB4  BLM15PD121SN1D  [FB0402_1005M_S]
OSC1  125MHz  [OSC-SMD_6P-L3.2-W2.5-BL-1]
OSC3  50MHz  [OSC-SMD_4P-L2.5-W2.0-BL-1]
R91  22Ω  [R0402_1005M_S]
R92  22Ω_NC  [R0402_1005M_S]
R132  100Ω  [R0402_1005M_S]  (no BOM)
R133  100Ω  [R0402_1005M_S]  (no BOM)
sheet FPGA CONFIG
C23  2.2uF  [C0402_1005M_S]
C25  2.2uF  [C0402_1005M]
C26  2.2uF  [C0402_1005M]
C160  2.2uF  [C0402_1005M]
D11  ESD5Z3.3T1G-MS  [SOD-523_L1.2-W0.8-LS1.6-RD]
LED2  NCD0603G1  [LED0603_1608M]
R22  510Ω  [R0402_1005M_S]
R23  510Ω_NC  [R0402_1005M_S]  (no BOM)
R25  22Ω  [R0402_1005M_S]
R26  1kΩ  [R0402_1005M_S]
R29  4.7kΩ  [R0402_1005M_S]
R30  4.7kΩ  [R0402_1005M_S]
R47  4.7kΩ_NC  [R0402_1005M_S]  (no BOM)
R110  22Ω  [R0402_1005M_S]
R113  18kΩ  [R0402_1005M_S]
R115  1kΩ  [R0402_1005M_S]
R116  1kΩ  [R0402_1005M_S]
SW8  DSHP01TSGET  [SW-SMD_DSHP01TSGET]
U1  XC7A35T-2CSG325C  [BGA324-CSG325_L15.0-W15.0-R18-C18-P0.80-BL]  (sections B0,B14,B15,B34,GND,GTP,POWER)
U15  W25Q128JVSIQ  [SOIC-8_L5.3-W5.3-P1.27-LS8.0-BL]
sheet FPGA GTP
C2  4.7uF  [C0603_1608M_S]
C3  4.7uF  [C0603_1608M_S]
C4  470nF  [C0402_1005M_BGA]
C5  470nF  [C0402_1005M_BGA]
C6  470nF  [C0402_1005M_BGA]
C7  470nF  [C0402_1005M_BGA]
R1  100Ω  [R0402_1005M_S]
sheet FPGA POWER
C24  2.2uF  [C0402_1005M_S]
C185  4.7uF  [C0603_1608M_S]
C186  2.2uF  [C0402_1005M]
C187  2.2uF  [C0402_1005M]
C188  2.2uF  [C0402_1005M]
C189  2.2uF  [C0402_1005M]
C193  2.2uF  [C0402_1005M_BGA]
C194  2.2uF  [C0402_1005M]
C195  2.2uF  [C0402_1005M]
C197  2.2uF  [C0402_1005M_S]
C198  4.7uF  [C0603_1608M_S]
C199  2.2uF  [C0402_1005M_BGA]
C200  4.7uF  [C0603_1608M_S]
sheet LED&BTN
D7  ESD5Z3.3T1G-MS  [SOD-523_L1.2-W0.8-LS1.6-RD]
LED4  NCD0603G1  [LED0603_1608M]
LED5  NCD0603G1  [LED0603_1608M_S]
R96  51Ω  [R0402_1005M_S]
R97  4.7kΩ  [R0402_1005M_S]
R131  4.7kΩ  [R0402_1005M_S]
SW6  SKRPACE010  [KEY-SMD_4P-L4.2-W3.2-P2.20-LS4.6]
sheet MCU(JTAG)
C201  100nF  [C0402_1005M_S]
C202  100nF  [C0402_1005M_S]
C203  100nF  [C0402_1005M_S]
C204  10pF  [C0402_1005M_S]
C205  10pF  [C0402_1005M_S]
D8  ESD5Z3.3T1G-MS  [SOD-523_L1.2-W0.8-LS1.6-RD]
LED6  NCD0603G1  [LED0603_1608M]
R89  51Ω  [R0402_1005M_S]
R135  22Ω  [R0402_1005M_S]
R136  22Ω  [R0402_1005M_S]
R137  22Ω  [R0402_1005M_S]
R138  22Ω  [R0402_1005M_S]
R139  4.7kΩ  [R0402_1005M_S]
R140  51Ω  [R0402_1005M_S]
SW7  SKRPACE010  [KEY-SMD_4P-L4.2-W3.2-P2.20-LS4.6]
U5  CH32V305GBU6  [QFN-28_L4.0-W4.0-P0.40-BL-EP2.8]
X2  12MHz  [CRYSTAL-SMD_4P-L3.2-W2.5-BL_Small]
sheet Mech&Conn
D6  RCLAMP0524P  [DFN2510-10_L2.5-W1.0-P0.50-BL]
D9  ESD5Z3.3T1G-MS  [SOD-523_L1.2-W0.8-LS1.6-RD]
D10  RCLAMP0522P.TCT  [UDFN-6_L1.6-W1.0-P0.50-BL]
H1  -  [M2.5螺丝安装孔_金属化_带过孔]
H2  -  [M2.5螺丝安装孔_金属化_带过孔]
H3  -  [M2.5螺丝安装孔_金属化_带过孔]
H4  -  [M2.5螺丝安装孔_金属化_带过孔]
R12  22Ω  [R0402_1005M_S]
R15  22Ω  [R0402_1005M_S]
R21  22Ω  [R0402_1005M_S]
R134  22Ω  [R0402_1005M_S]
U16  ZX-SH1.0-8PWT  [CONN-SMD_8P-P1.00_MEGASTAR_ZX-SH1.0-8PWT]
sheet SYS_POWER
C170  10nF  [C0402_1005M_S]
C171  2.2uF  [C0402_1005M]
C173  2.2uF  [C0402_1005M]
C174  2.2uF  [C0402_1005M]
C175  2.2uF  [C0402_1005M]
C176  2.2uF  [C0402_1005M]
C206  10uF  [C0603_1608M_S]
C207  10uF  [C0603_1608M_S]
CBB1  -
F1  SMD0805-050-6  [F0805]
FB6  BLM15PD121SN1D  [FB0402_1005M_S]
FB7  BLM18PG121SN1D  [FB0603_1608M]
FB8  BLM15PD121SN1D  [FB0402_1005M_S]
R111  18kΩ  [R0402_1005M_S]
R112  18kΩ  [R0402_1005M_S]
U4  TLV73312PQDRVRQ1  [WSON-6_L2.0-W2.0-P0.65-TL-EP]
sheet USB&BTB
CBB2  -
CN7  X0802FVS-80AS-LPV01  [CONN-SMD_80P-P0.80_XKB_X0802FVS-80AS-LPV01]
CN8  X0802FVS-80AS-LPV01  [CONN-SMD_80P-P0.80_XKB_X0802FVS-80AS-LPV01]

## Library data of the parts
C4-C7 C161-C164 C177 C178 C180 C181 = CC0402KRX7R6BB474: 容值:470nF;精度:±10%;额定电压:10V;材质(温度系数):X7R;; LCSC Part Name: 470nF ±10% 10V; Supplier Part: C723358; Manufacturer: YAGEO(国巨); Supplier Footprint: 0402; JLCPCB Part Class: Extended Part; Datasheet: https://atta.szlcsc.com/upload/public/pdf/source/20200814/C723358_954534B57338CDD6F563240A164D6507.pdf; Supplier: LCSC; Tolerance: ±10%; Voltage Rated: 10V; Temperature Coefficient: X7R
C2 C3 C165 C166 C179 C182 C185 C198 C200 = GRM188Z71A475KE15D: 容值:4.7uF;精度:±10%;额定电压:10V;材质(温度系数):X7R;; LCSC Part Name: 4.7uF ±10% 10V; Supplier Part: C913474; Manufacturer: muRata(村田); Supplier Footprint: 0603; JLCPCB Part Class: Extended Part; Datasheet: https://atta.szlcsc.com/upload/public/pdf/source/20201110/C913474_4DF5AD40636EBA2467CAA7A6A4C37EEF.pdf; Supplier: LCSC; Tolerance: ±10%; Voltage Rated: 10V; Temperature Coefficient: X7R
C12-C15 = C0402: 容值:100nF;精度:±10%;额定电压:16V;材质(温度系数):X7R;; LCSC Part Name: 100nF ±10% 16V; Supplier Part: C60474; Manufacturer: YAGEO(国巨); Manufacturer Part: CC0402KRX7R7BB104; Supplier Footprint: 0402; Datasheet: https://atta.szlcsc.com/upload/public/pdf/source/20211223/9278FD768280B81DDBEF48FA36411A03.pdf; Supplier: LCSC; Tolerance: ±10%; Voltage Rated: 16V; Temperature Coefficient: X7R
C157-C159 C190 = GRM155R61A106ME11D: 容值:10uF;精度:±20%;额定电压:10V;材质(温度系数):X5R;; LCSC Part Name: 10uF ±20% 10V; Supplier Part: C408132; Manufacturer: muRata(村田); Supplier Footprint: 0402; JLCPCB Part Class: Extended Part; Datasheet: https://atta.szlcsc.com/upload/public/pdf/source/20200305/C490387_23319AE8C154DEB24C505E6C82A8106A.pdf; Supplier: LCSC; Tolerance: ±20%; Voltage Rated: 10V; Temperature Coefficient: X5R
FB4 FB6 FB8 = BLM15PD121SN1D: 标称阻抗@测试频率:120Ω@100MHz;误差:±25%;直流电阻(RDC):90mΩ;; LCSC Part Name: 单路 0402磁珠 阻抗120Ω@100MHz; Supplier Part: C76891; Manufacturer: muRata(村田); Supplier Footprint: 0402; JLCPCB Part Class: Extended Part; Datasheet: https://atta.szlcsc.com/upload/public/pdf/source/20181120/C333978_3E581FB55966932B05020139ABDE8E01.pdf; Supplier: LCSC; Impedance @ Frequency: 120Ω@100MHz; Tolerance: ±25%; DC Resistance: 90mΩ; Current Rating: 1.3A; Circuits: 1
OSC1 = SX3DF125.000B20F30DNN: 频率:125MHz;常温频差:±20ppm;输出模式:LVDS;工作电压:3.3V;工作电流:40mA;频率稳定度:±20ppm;; LCSC Part Name: 125MHz ±20ppm 3.3V LVDS; Supplier Part: C5179991; Manufacturer: SCTF(星通时频); Supplier Footprint: SMD3225-6P; JLCPCB Part Class: Extended Part; Datasheet: https://item.szlcsc.com/datasheet/SX3DF125.000B20F30DNN/5836853.html; Supplier: LCSC; Normal temperature Frequency Tolerance: ±20ppm; Output Type: LVDS; Voltage - Supply: 3.3V; Current - Supply: 40mA; Frequency Stability: ±20ppm; Operating Temperature: -40℃~+85℃
OSC3 = OT3EL89CJI-111YLC-50M: 频率:50MHz;常温频差:±10ppm;输出模式:CMOS;工作电压:1.8V~3.3V;; LCSC Part Name: 50MHZ 1.8V-3.3V ±10PPM YSO110TR; Supplier Part: C7434935; Manufacturer: YXC(扬兴晶振); Supplier Footprint: SMD2520-4P; JLCPCB Part Class: 扩展库; Datasheet: https://atta.szlcsc.com/upload/public/pdf/source/20230629/F4E9687FE005AFC8DB3875D384C2C018.pdf; Supplier: LCSC; Normal temperature Frequency Tolerance: ±10ppm; Output Type: CMOS; Supply Voltage: 1.8V~3.3V; Operating Temperature: -40℃~+85℃; Frequency Stability(Full temperature range): ±50ppm
R12 R15 R21 R25 R91 R92 R110 R135-R138 = 0402WGF220JTCE: 阻值:22Ω;精度:±1%;功率:62.5mW;温度系数:±100ppm/℃;电阻类型:厚膜电阻;; LCSC Part Name: 22Ω ±1% 62.5mW 厚膜电阻; Supplier Part: C25092; Manufacturer: UNI-ROYAL(厚声); Supplier Footprint: 0402; JLCPCB Part Class: 基础库; Datasheet: https://atta.szlcsc.com/upload/public/pdf/source/20200306/C422600_1E6D84923E4A46A82E41ADD87F860B5C.pdf; Supplier: LCSC; Tolerance: ±1%; Power(Watts): 62.5mW; Overload Voltage (Max): 50V; Temperature Coefficient: ±100ppm/℃; Type: 厚膜电阻; Operating Temperature Range: -55℃~+155℃
R1 R132 R133 = 0402WGF1000TCE: 电阻类型:厚膜电阻;阻值:100Ω;精度:±1%;功率:62.5mW;最大工作电压:50V;温度系数:±200ppm/℃;; LCSC Part Name: 100Ω ±1% 62.5mW 厚膜电阻; Supplier Part: C25076; Manufacturer: UNI-ROYAL(厚声); Supplier Footprint: 0402; JLCPCB Part Class: Basic Part; Datasheet: https://atta.szlcsc.com/upload/public/pdf/source/20200306/C422600_1E6D84923E4A46A82E41ADD87F860B5C.pdf; Supplier: LCSC; Type: 厚膜电阻; Tolerance: ±1%; Power(Watts): 62.5mW; Overload Voltage (Max): 50V; Temperature Coefficient: ±200ppm/℃; Operating Temperature Range: -55℃~+155℃
C23-C26 C160 C171 C173-C176 C186-C189 C193-C195 C197 C199 = GRM155Z71A225KE01D: 容值:2.2uF;精度:±10%;额定电压:10V;材质(温度系数):X7R;; LCSC Part Name: 2.2uF ±10% 10V; Supplier Part: C2997286; Manufacturer: muRata(村田); Supplier Footprint: 0402; JLCPCB Part Class: Extended Part; Datasheet: https://atta.szlcsc.com/upload/public/pdf/source/20220829/B8FE0067CE648DEA50203A5BE382F6B9.pdf; Supplier: LCSC; Tolerance: ±10%; Voltage Rated: 10V; Temperature Coefficient: X7R
D7 D8 D11 = ESD5Z3.3T1G-MS: 极性:单向;反向截止电压(Vrwm):3.3V;钳位电压:14.1V;峰值脉冲电流(Ipp):11.2A;峰值脉冲功率(Ppp):200W;击穿电压:5V;; LCSC Part Name: 单向ESD 3.3V截止 峰值浪涌电流：11.2A; Supplier Part: C3008119; Manufacturer: MSKSEMI(美森科); Supplier Footprint: SOD-523; JLCPCB Part Class: Extended Part; Datasheet: https://item.szlcsc.com/datasheet/ESD5Z3.3T1G-MS/3498467.html; Supplier: LCSC; Polarity: 单向; Reverse Stand-Off Voltage (Vrwm): 3.3V; Clamping Voltage: 14.1V; Peak Pulse Current (Ipp): 11.2A; Peak Pulse Power Dissipation (Ppp): 200W; Voltage - Breakdown: 5V; Reverse Leakage Current (Ir): 1uA; Number of Channels: 单路; level of protection: IEC 61000-4-2; Type: ESD; Junction Capacitance: 12pF
LED2 LED4-LED6 = NCD0603G1: 发光颜色:翠绿色;正向电压(VF):2.6V~3.6V;功率:72mW;正向电流:10mA;主波长:515nm~530nm;透镜颜色:无色透明透镜;发光强度:330mcd~900mcd;发光角度:130°;工作温度:-30℃~+85℃;; Supplier Part: C84267; Manufacturer: 国星光电; Supplier Footprint: 0603; JLCPCB Part Class: Extended Part; Datasheet: https://atta.szlcsc.com/upload/public/pdf/source/20200820/C84267_04BA7703640BAC111D09F5EFB971FBF3.pdf; Supplier: LCSC; Emitted Color: 翠绿色; Forward Voltage (VF): 2.6V~3.6V; Power Dissipation: 72mW; Forward Current: 10mA; Dominant Wavelength: 515nm~530nm; Lens Color: 无色透明透镜; Luminous Intensity: 330mcd~900mcd; Viewing Angle: 130°; Operating Temperature: -30℃~+85℃
R22 R23 = 0402WGF5100TCE: 电阻类型:厚膜电阻;阻值:510Ω;精度:±1%;功率:62.5mW;最大工作电压:50V;温度系数:±100ppm/℃;; LCSC Part Name: 510Ω ±1% 62.5mW 厚膜电阻; Supplier Part: C25123; Manufacturer: UNI-ROYAL(厚声); Supplier Footprint: 0402; JLCPCB Part Class: 基础库; Datasheet: https://atta.szlcsc.com/upload/public/pdf/source/20200306/C422600_1E6D84923E4A46A82E41ADD87F860B5C.pdf; Supplier: LCSC; Type: 厚膜电阻; Tolerance: ±1%; Power(Watts): 62.5mW; Overload Voltage (Max): 50V; Temperature Coefficient: ±100ppm/℃; Operating Temperature Range: -55℃~+155℃
R26 = 0402WGF1001TCE: 电阻类型:厚膜电阻;阻值:1kΩ;精度:±1%;功率:62.5mW;最大工作电压:50V;温度系数:±100ppm/℃;; LCSC Part Name: 1kΩ ±1% 62.5mW 厚膜电阻; Supplier Part: C11702; Manufacturer: UNI-ROYAL(厚声); Supplier Footprint: 0402; JLCPCB Part Class: 基础库; Datasheet: https://atta.szlcsc.com/upload/public/pdf/source/20200306/C422600_1E6D84923E4A46A82E41ADD87F860B5C.pdf; Supplier: LCSC; Type: 厚膜电阻; Tolerance: ±1%; Power(Watts): 62.5mW; Overload Voltage (Max): 50V; Temperature Coefficient: ±100ppm/℃; Operating Temperature Range: -55℃~+155℃
R29 R30 R47 R97 R131 R139 = 0402WGF4701TCE: 电阻类型:厚膜电阻;阻值:4.7kΩ;精度:±1%;功率:62.5mW;最大工作电压:50V;温度系数:±100ppm/℃;; LCSC Part Name: 4.7kΩ ±1% 62.5mW 厚膜电阻; Supplier Part: C25900; Manufacturer: UNI-ROYAL(厚声); Supplier Footprint: 0402; JLCPCB Part Class: 基础库; Datasheet: https://atta.szlcsc.com/upload/public/pdf/source/20200306/C422600_1E6D84923E4A46A82E41ADD87F860B5C.pdf; Supplier: LCSC; Type: 厚膜电阻; Tolerance: ±1%; Power(Watts): 62.5mW; Overload Voltage (Max): 50V; Temperature Coefficient: ±100ppm/℃; Operating Temperature Range: -55℃~+155℃
R111-R113 = 0402WGF1802TCE: 电阻类型:厚膜电阻;阻值:18kΩ;精度:±1%;功率:62.5mW;最大工作电压:50V;温度系数:±100ppm/℃;; LCSC Part Name: 18kΩ ±1% 62.5mW 厚膜电阻; Supplier Part: C25762; Manufacturer: UNI-ROYAL(厚声); Supplier Footprint: 0402; JLCPCB Part Class: 扩展库; Datasheet: https://atta.szlcsc.com/upload/public/pdf/source/20200306/C422600_1E6D84923E4A46A82E41ADD87F860B5C.pdf; Supplier: LCSC; Type: 厚膜电阻; Tolerance: ±1%; Power(Watts): 62.5mW; Overload Voltage (Max): 50V; Temperature Coefficient: ±100ppm/℃; Operating Temperature Range: -55℃~+155℃
R115 R116 = 0402WGF1001TCE: 电阻类型:厚膜电阻;阻值:1kΩ;精度:±1%;功率:62.5mW;最大工作电压:50V;温度系数:±100ppm/℃;; LCSC Part Name: 1kΩ ±1% 62.5mW 厚膜电阻; Supplier Part: C11702; Manufacturer: UNI-ROYAL(厚声); Supplier Footprint: 0402; JLCPCB Part Class: Basic Part; Datasheet: https://atta.szlcsc.com/upload/public/pdf/source/20200306/C422600_1E6D84923E4A46A82E41ADD87F860B5C.pdf; Supplier: LCSC; Type: 厚膜电阻; Tolerance: ±1%; Power(Watts): 62.5mW; Overload Voltage (Max): 50V; Temperature Coefficient: ±100ppm/℃; Operating Temperature Range: -55℃~+155℃
SW8 = DSHP01TSGET: 类型:平拨,凹槽式;电路结构:单刀单掷;开关位数:1位;使用寿命:-;颜色:黑色;; LCSC Part Name: 1位低推贴胶; Supplier Part: C126848; Manufacturer: YE; Supplier Footprint: SMD,2.9x5.4mm; JLCPCB Part Class: 扩展库; Datasheet: https://atta.szlcsc.com/upload/public/pdf/source/20220428/74B573882803886B9DF6FBBC1614692A.pdf; Supplier: LCSC; Type: 平拨,凹槽式; Circuit: 单刀单掷; Number of Positions: 1位; Color: 黑色
U1 = XC7A35T-2CSG325C: 优化符号; LCSC Part Name: - XC7A35T 2CSG325C; Supplier Part: C1521720; Manufacturer: AMD/XILINX(赛灵思); Supplier Footprint: CSBGA-324; JLCPCB Part Class: Extended Part; Datasheet: https://atta.szlcsc.com/upload/public/pdf/source/20210703/C1E6749F740AED67D29FCAB95332545E.pdf; Supplier: LCSC
U15 = W25Q128JVSIQ: 接口类型:SPI;存储容量:128Mbit;时钟频率(fc):133MHz;; LCSC Part Name: W25Q128JVSIQ 编带; Supplier Part: C97521; Manufacturer: WINBOND(华邦); Supplier Footprint: SOIC-8-208mil; JLCPCB Part Class: Basic Part; Datasheet: https://atta.szlcsc.com/upload/public/pdf/source/20170316/1489627409956.pdf; Supplier: LCSC; Interface Type: SPI; Memory Size: 128Mbit; Clock Frequency (fc): 133MHz; Supply Voltage: 2.7V~3.6V; Page Programming Time (Tpp): 700us; Block Erase Time (tBE): 120ms@(32KB); Data Retention - TDR (Year): 20年; Operating Temperature: -40℃~+85℃
R89 R96 R140 = 0402WGF510JTCE: 电阻类型:厚膜电阻;阻值:51Ω;精度:±1%;功率:62.5mW;最大工作电压:50V;温度系数:±100ppm/℃;; LCSC Part Name: 51Ω ±1% 62.5mW 厚膜电阻; Supplier Part: C25125; Manufacturer: UNI-ROYAL(厚声); Supplier Footprint: 0402; JLCPCB Part Class: Extended Part; Datasheet: https://atta.szlcsc.com/upload/public/pdf/source/20200306/C422600_1E6D84923E4A46A82E41ADD87F860B5C.pdf; Supplier: LCSC; Type: 厚膜电阻; Tolerance: ±1%; Power(Watts): 62.5mW; Overload Voltage (Max): 50V; Temperature Coefficient: ±100ppm/℃; Operating Temperature Range: -55℃~+155℃
SW6 SW7 = SKRPACE010: 小白按钮 / 电路结构:单刀单掷;按钮形状:椭圆形按钮;安装方式:立贴;开关长度:4.2mm;开关宽度:3.2mm;开关高度:2.5mm;触点电流:50mA;额定电压(DC):16V;带灯:-;机械寿命:-;; Supplier: LCSC; Manufacturer: ALPSALPINE(阿尔卑斯阿尔派); Supplier Part: C139797; JLCPCB Part Class: 扩展库; LCSC Part Name: 4.2*3.2*2.5mm 立贴 轻触开关; Supplier Footprint: SMD; Datasheet: https://atta.szlcsc.com/upload/public/pdf/source/20171113/C139797_15105612676371115729.pdf; Circuit: 单刀单掷; Actuator Style: 椭圆形按钮; Mounting Style: 立贴; Switch Length: 4.2mm; Switch Width: 3.2mm; Switch Height: 2.5mm; Contact Current: 50mA; Voltage Rating (DC): 16V
C201-C203 = CC0402KRX7R9BB104: 容值:100nF;精度:±10%;额定电压:50V;材质(温度系数):X7R;; Supplier Footprint: 0402; Voltage Rated: 50V; Temperature Coefficient: X7R; LCSC Part Name: 100nF ±10% 50V; Supplier Part: C131394; Manufacturer: YAGEO(国巨); JLCPCB Part Class: Extended Part; Datasheet: https://atta.szlcsc.com/upload/public/pdf/source/20181008/C309510_22F155564471FAF6A489F7D68F34234E.pdf; Supplier: LCSC; Tolerance: ±10%
C204 C205 = 0402CG100J500NT: 容值:10pF;精度:±5%;额定电压:50V;温度系数:C0G;; LCSC Part Name: 10pF ±5% 50V; Supplier Part: C1545; Manufacturer: FH(风华); Supplier Footprint: 0402; JLCPCB Part Class: Extended Part; Datasheet: https://item.szlcsc.com/datasheet/0402CG100J500NT/1897.html; Supplier: LCSC; Tolerance: ±5%; Voltage Rating: 50V; Temperature Coefficient: C0G
U5 = CH32V305GBU6: CH32V 系列是基于青稞RISC-V 内核设计的工业级通用微控制器，包括CH32V305 连接型MCU、CH32V307/CH32V317 互联型MCU、CH32V208 无线型MCU 等。CH32V30x 和CH32V31x 系列基于青稞V4F 微处理器设计，支持单精度浮点指令和快速中断响应，支持144MHz 主频零等待运行，提供8 组串口、4 组电机PWM 高级定时器、SDIO、DVP 数字图像接口、4 组模拟运放、双ADC 单元、双DAC 单元，内置USB2.0 高速PHY 收发器（480Mbps; LCSC Part Name: 基于青稞RISC-V内核的工业级通用微控制器; Supplier Part: C19100608; Manufacturer: WCH(南京沁恒); Supplier Footprint: QFN-28(4x4); JLCPCB Part Class: Extended Part; Datasheet: https://item.szlcsc.com/datasheet/CH32V305GBU6/20310896.html; Supplier: LCSC
X2 = 无源晶振_3225_12.000Mhz: 频率:12MHz;晶振类型:贴片无源晶振;负载电容:10pF;频率公差:±10ppm;等效串联电阻(ESR):90Ω;频率稳定度:±10ppm;工作温度:-30℃~+85℃;; LCSC Part Name: 12MHz ±10ppm 10pF; Supplier Part: C2842186; Manufacturer: HCI(杭晶); Manufacturer Part: XC32M4-12.000-F10NNFT; Supplier Footprint: SMD3225-4P; Datasheet: https://atta.szlcsc.com/upload/public/pdf/source/20210629/C2842185_12E86E947EE3FFA6E73C7D20D0BFB409.pdf; Supplier: LCSC; Operating Temperature: -30℃~+85℃; Crystal Type: 贴片无源晶振; Load Capacitance: 10pF; Frequency Tolerance: ±10ppm; Equivalent Series Resistance (ESR): 90Ω; Frequency Stability: ±10ppm
D6 = RCLAMP0524P_C907837: 极性:单向;反向截止电压(Vrwm):5V;最大钳位电压:17V;峰值脉冲电流(Ipp):4.5A;击穿电压:6.8V;; Supplier Part: C907837; Manufacturer: TECH PUBLIC(台舟); Supplier Footprint: DFN2510-10; JLCPCB Part Class: 扩展库; Datasheet: https://atta.szlcsc.com/upload/public/pdf/source/20210810/AE3DE9AC94AD2A317FD9BEA10653400F.pdf; Supplier: LCSC; polarity: 单向; Reverse Stand-Off Voltage (Vrwm): 5V; Maximum Clamping Voltage: 17V; Peak Pulse Current (Ipp): 4.5A; Breakdown Voltage: 6.8V; Reverse Leakage Current (Ir): 80nA; Number of Lines: 四路; Operating Temperature: -55℃~+125℃; level of protection: IEC 61000-4-2; Type: ESD
D9 = ESD5Z3.3T1G-MS: 极性:单向;反向截止电压(Vrwm):3.3V;钳位电压:14.1V;峰值脉冲电流(Ipp):11.2A;峰值脉冲功率(Ppp):200W;击穿电压:5V;; LCSC Part Name: 单向ESD 3.3V截止 峰值浪涌电流：11.2A; Supplier Part: C3008119; Manufacturer: MSKSEMI(美森科); Supplier Footprint: SOD-523; JLCPCB Part Class: 扩展库; Datasheet: https://item.szlcsc.com/datasheet/ESD5Z3.3T1G-MS/3498467.html; Supplier: LCSC; Polarity: 单向; Reverse Stand-Off Voltage (Vrwm): 3.3V; Clamping Voltage: 14.1V; Peak Pulse Current (Ipp): 11.2A; Peak Pulse Power Dissipation (Ppp): 200W; Voltage - Breakdown: 5V; Reverse Leakage Current (Ir): 1uA; Number of Channels: 单路; level of protection: IEC 61000-4-2; Type: ESD; Junction Capacitance: 12pF
D10 = RCLAMP0522P.TCT: 反向截止电压(Vrwm):5V;钳位电压:15V;峰值脉冲电流(Ipp):5A@8/20us;峰值脉冲功率(Ppp):150W@8/20us;击穿电压:6V;; Supplier Part: C112169; Manufacturer: SEMTECH; Supplier Footprint: SLP1610-4; JLCPCB Part Class: 扩展库; Datasheet: https://item.szlcsc.com/datasheet/RCLAMP0522P.TCT/113401.html; Supplier: LCSC; Reverse Stand-Off Voltage (Vrwm): 5V; Clamping Voltage: 15V; Peak Pulse Current (Ipp): 5A@8/20us; Peak Pulse Power Dissipation (Ppp): 150W@8/20us; Voltage - Breakdown: 6V; Reverse Leakage Current (Ir): 1uA; Number of Channels: 双路; Operating Temperature: -55℃~+125℃@(Tj); level of protection: IEC 61000-4-4；IEC 61000-4-5；IEC 61000-4-2; Type: TVS; Junction Capacitance: 0.3pF
H1-H4 = M2.5螺丝安装孔_金属化: 金属化连接的安装孔
R134 = 0402WGF220JTCE: 电阻类型:厚膜电阻;阻值:22Ω;精度:±1%;功率:62.5mW;最大工作电压:50V;温度系数:±100ppm/℃;; LCSC Part Name: 22Ω ±1% 62.5mW 厚膜电阻; Supplier Part: C25092; Manufacturer: UNI-ROYAL(厚声); Supplier Footprint: 0402; JLCPCB Part Class: Basic Part; Datasheet: https://atta.szlcsc.com/upload/public/pdf/source/20200306/C422600_1E6D84923E4A46A82E41ADD87F860B5C.pdf; Supplier: LCSC; Tolerance: ±1%; Power(Watts): 62.5mW; Overload Voltage (Max): 50V; Temperature Coefficient: ±100ppm/℃; Type: 厚膜电阻; Operating Temperature Range: -55℃~+155℃
U16 = ZX-SH1.0-8PWT: 插针结构:1x8P;间距:1mm;安装方式:卧贴;参考系列:SH;总PIN数:8P;排数:1;每排PIN数:8;行距:-;额定电流:1A;触头材质:黄铜;触头镀层:锡;工作温度:-;; LCSC Part Name: 1x8P 间距:1mm 卧贴 系列:SH; Supplier Part: C7430450; Manufacturer: Megastar(兆星); Supplier Footprint: SMD,P=1mm,卧贴; JLCPCB Part Class: 扩展库; Datasheet: https://item.szlcsc.com/datasheet/ZX-SH1.0-8PWT/8430319.html; Supplier: LCSC; Pins Structure: 1x8P; Pitch: 1mm; Mounting Type: 卧贴; Reference Series: SH; Number of Pins: 8P; Number of Rows: 1; Number of PINs Per Row: 8; Current Rating: 1A; Contact Material: 黄铜; Contact Plating: 锡; Supplementary Features: 辅助焊脚; Color: 米色; Z-Height of the Board: 3.15mm; X-Length of Bottom Edge on Board (Spacing Line): 10.35mm; Y-Width of Bottom Edge on Board: 5.05mm
C170 = CC0402KRX7R9BB103: 容值:10nF;精度:±10%;额定电压:50V;材质(温度系数):X7R;; LCSC Part Name: 10nF ±10% 50V; Supplier Part: C60133; Manufacturer: YAGEO(国巨); Supplier Footprint: 0402; JLCPCB Part Class: Extended Part; Datasheet: https://atta.szlcsc.com/upload/public/pdf/source/20180224/C181747_15194369449651363981.pdf; Supplier: LCSC; Tolerance: ±10%; Voltage Rated: 50V; Temperature Coefficient: X7R
C206 C207 = GRM188Z71A106KA73D: 容值:10uF;精度:±10%;额定电压:10V;材质(温度系数):X7R;; Supplier Footprint: 0603; Voltage Rated: 10V; Temperature Coefficient: X7R; LCSC Part Name: 10uF ±10% 10V; Supplier Part: C2959727; Manufacturer: muRata(村田); JLCPCB Part Class: 扩展库; Datasheet: https://atta.szlcsc.com/upload/public/pdf/source/20220328/6A4892B7E841253269A84FFE395E0578.pdf; Supplier: LCSC; Tolerance: ±10%
F1 = SMD0805-050-6: 耐压:6V;最大电流:40A;保持电流(Ih):500mA;跳闸电流:1A;; Supplier Part: C46640983; Manufacturer: 宏嘉诚; Supplier Footprint: 0805; Datasheet: https://atta.szlcsc.com/upload/public/pdf/source/20250414/C7C75E40B18789A4A1352E9E468D2637.pdf; Supplier: LCSC; Voltage - Max: 6V; Current - Max: 40A; Hold Current: 500mA; Trip Current: 1A; Power Dissipation: 500mW; Resistance - Initial (Ri) (Min): 100mΩ; Resistance - Post Trip (R1) (Max): 850mΩ; Time to Trip(Max): 100ms
FB7 = BLM18PG121SN1D: 阻抗@频率:120Ω@100MHz;误差:±25%;直流电阻(DCR):50mΩ;; LCSC Part Name: 单路 0603磁珠 阻抗120Ω@100MHz; Supplier Part: C14709; Manufacturer: muRata(村田); Supplier Footprint: 0603; JLCPCB Part Class: Basic Part; Datasheet: https://item.szlcsc.com/datasheet/BLM18PG121SN1D/15379.html; Supplier: LCSC; Impedance @ Frequency: 120Ω@100MHz; Tolerance: ±25%; DC Resistance(DCR): 50mΩ; Current Rating: 2A; Number of Circuits: 1; Operating Temperature: -55℃~+125℃
U4 = TLV73312PQDRVRQ1: 输出类型:固定;最大输入电压:5.5V;输出电压:1.2V;输出电流:300mA;输出极性:正极;; LCSC Part Name: 具有使能功能的汽车类 300mA、低 IQ、低压降稳压器; Supplier Part: C2863369; Manufacturer: TI(德州仪器); Supplier Footprint: WSON-6-EP(2x2); JLCPCB Part Class: Extended Part; Datasheet: https://www.ti.com/cn/lit/gpn/tlv733p-q1; Supplier: LCSC; Output Type: 固定; Maximum Input Voltage: 5.5V; Output Voltage: 1.2V; Output Current: 300mA; Dropout Voltage: 450mV@(300mA); standby current: 62uA; Feature: 防静电保护；浪涌保护；车规认证；自动放电功能；低ESR；热保护(TSD)；欠压闭锁；过流保护(OCP)；带使能；防倒灌; Operating Temperature: -40℃~+125℃@(Ta); Output Polarity: 正极; Number of Outputs: 1
CN7 CN8 = X0802FVS-80AS-LPV01: 配套:公座X0802WVS-80AS-LPV01 母座X0802FVS-80AS-LPV01; Supplier Part: C5291137; Manufacturer: XKB Connection(中国星坤); Supplier Footprint: SMD,P=0.8mm; JLCPCB Part Class: Extended Part; Datasheet: https://atta.szlcsc.com/upload/public/pdf/source/20211215/964657FDD52AC7AD7BD4D76A79F09038.pdf; Supplier: LCSC

## Nets
GND: C2.1 C3.1 C4.1 C5.1 C6.1 C7.1 C23.1 C24.1 C25.1 C26.1 C157.1 C158.1 C159.1 C160.1 C161.1 C162.1 C163.1 C164.1 C165.1 C166.1 C170.1 C171.1 C173.1 C174.1 C175.1 C176.1 C177.1 C178.1 C179.1 C180.1 C181.1 C182.1 C185.1 C186.1 C187.1 C188.1 C189.1 C190.1 C193.1 C194.1 C195.1 C197.1 C198.1 C199.1 C200.1 C201.1 C202.1 C203.1 C204.1 C205.1 C206.1 C207.1 CBB1.2(GND) CN7.2 CN7.4 CN7.9 CN7.10 CN7.15 CN7.16 CN7.21 CN7.22 CN7.27 CN7.28 CN7.33 CN7.42 CN7.47 CN7.56 CN7.61 CN7.70 CN7.75 CN7.76 CN8.9 CN8.10 CN8.23 CN8.24 CN8.37 CN8.38 CN8.51 CN8.52 CN8.65 CN8.66 CN8.71 CN8.76 CN8.77 CN8.79 D6.3(GND) D6.8(GND) D7.2(A) D8.2(A) D9.2(A) D10.3(GND) D10.4(GND) D11.2(A) H1.1 H2.1 H3.1 H4.1 LED4.1(C) LED5.1(C) LED6.1(C) OSC1.3(GND) OSC3.2(GND) R23.1 R92.1 R115.2 SW6.3 SW6.4 SW7.3 SW7.4 U1.B3(GND) U1.B7(GND) U1.B8(GND) U1.B18(GND) U1.C2(GND) U1.C6(GND) U1.C7(GND) U1.C15(GND) U1.D3(GND) U1.D4(GND) U1.D7(GND) U1.D12(GND) U1.E2(GND) U1.E6(GND) U1.E7(GND) U1.E8(CCLK_0) U1.E9(GND) U1.F4(GND) U1.F6(GND) U1.F10(GND) U1.F16(GND) U1.G1(GND) U1.G5(GND) U1.G6(GND) U1.G7(GND) U1.G9(GND) U1.G11(GND) U1.G13(GND) U1.H3(GND) U1.H4(GND) U1.H5(GND) U1.H6(GND) U1.H8(GND) U1.H10(GND) U1.H12(GND) U1.J1(GND) U1.J2(GND) U1.J3(GND) U1.J7(GND) U1.J11(GND) U1.J13(GND) U1.J17(GND) U1.K4(GND) U1.K8(GND) U1.K10(VP_0) U1.K12(GND) U1.K14(GND) U1.L1(GND) U1.L7(GND) U1.L9(VN_0) U1.L11(GND) U1.L13(GND) U1.M8(GND) U1.M10(DXP_0) U1.M12(GND) U1.M18(GND) U1.N5(GND) U1.N7(GND) U1.N9(GND) U1.N11(GND) U1.N13(GND) U1.N15(GND) U1.P2(GND) U1.P8(GND) U1.P12(GND) U1.R9(GND) U1.R10(VCCO_0) U1.T6(GND) U4.3(GND) U4.7(EP) U5.20(VSS/GND) U5.29(EP) U15.4(GND) U16.6 U16.9 U16.10 X2.2(GND) X2.4(GND)
VBUS_5V: C206.2 F1.1
VCC_1V0: C173.2 C185.2 C186.2 C187.2 C188.2 C189.2 C193.2 C199.2 C200.2 CBB1.3(VOUT1) FB8.1 U1.J12(VCCINT) U1.K7(VCCINT) U1.K11(VCCINT) U1.L8(VCCINT) U1.L12(VCCINT) U1.M7(VCCINT) U1.M11(VCCINT) U1.N8(VCCINT) U1.N10(VCCINT) U1.N12(VCCINT) U1.P9(VCCINT) U1.P11(VCCINT)
VCC_1V8: C23.2 C24.2 C171.2 C194.2 C195.2 C197.2 C198.2 CBB1.6(VOUT4) CN8.78 FB6.1 U1.F11(VCCBRAM) U1.G10(VCCBRAM) U1.H11(VCCBRAM)
VCC_1V8_F: C174.2 FB6.2 U4.4(EN) U4.5(NC) U4.6(IN)
VCC_2V5: C158.2 C177.2 C178.2 C179.2 CBB1.5(VOUT3) CN7.3 CN8.73 FB4.1 U1.H15(VCCO_15)
VCC_2V5_CLK: C157.2 C159.2 FB4.2 OSC3.4(VCC)
VCC_3V3: C25.2 C26.2 C160.2 C161.2 C162.2 C163.2 C164.2 C165.2 C166.2 C180.2 C181.2 C182.2 C190.2 C202.2 C203.2 CBB1.4(VOUT2) CN8.75 OSC1.6(VDD) R22.2 R26.2 R29.2 R30.2 R47.2 R113.2 R116.2 R134.1 SW8.2(B1) U1.E11(VCCBATT_0) U1.L16(VCCO_14) U5.6(VIO) U5.21(VDD) U15.8(VCC)
VCC_5V: C207.2 CBB1.1(VIN) CN7.1 CN8.80 FB7.2 R111.1 R112.1
CH32_NRST: C201.2 U5.3(NRST)
CH32_USB2_D_N: U5.27(PB6/USB2DM/UART1TX1)
CH32_USB2_D_P: U5.28(PB7/USB2DP/UART1RX1)
CLK_50M: R91.2 U1.C16(IO_L16P_T2_A28_15)
CLK_125M_N: C13.1 OSC1.4(OUT+) R132.2
CLK_125M_P: C12.1 OSC1.5(OUT-) R132.1
FPGA_CCLK: R110.1
FPGA_DONE: CN8.34 LED2.1(C) R47.1 U1.R12(M0_0)
FPGA_M0: R116.1
FPGA_M1: D11.1(C) R115.1 SW8.1(A1)
FPGA_PUDC_B: R22.1 R23.2 U1.L15(IO_L6P_T0_FCS_B_14)
FPGA_QSPI_CLK: CN7.80 R110.2 U15.6(CLK)
FPGA_QSPI_CS: R113.1 U1.N16(IO_L9P_T1_DQS_14) U15.1(CS#)
FPGA_QSPI_DQ0: U1.K17(IO_L4P_T0_D04_14) U15.5(DI)
FPGA_QSPI_DQ1: CN7.78 U1.L18(IO_L4N_T0_D05_14) U15.2(DO)
FPGA_QSPI_DQ2: U1.J14(IO_L5P_T0_D06_14) U15.3(IO2)
FPGA_QSPI_DQ3: U1.K15(IO_L5N_T0_D07_14) U15.7(IO3)
FPGA_TCK: R15.1 R137.2 U1.P10(PROGRAM_B_0)
FPGA_TCK_R: D6.4(I/O3) D6.7(NC) R15.2 U16.7
FPGA_TDI: R25.1 U1.T10(INIT_B_0)
FPGA_TDI_R: D6.2(I/O2) D6.9(NC) R25.2 R136.2 U16.5
FPGA_TDO: R12.1 R138.2 U1.F12(DONE_0)
FPGA_TDO_R: D6.1(I/O1) D6.10(NC) R12.2 U16.4
FPGA_TMS: R21.1 R135.2
FPGA_TMS_R: D6.5(I/O4) D6.6(NC) R21.2 U16.8
INIT_B: R30.1 U1.R11(M1_0)
IO_0_14: U1.K18(IO_L3N_T0_DQS_EMCCLK_14)
IO_0_15: U1.A9(IO_L3N_T0_DQS_AD1N_15)
IO_0_34: U1.K1(IO_L3N_T0_DQS_34)
IO_25_14: R97.1
IO_L1N_T0_34: U1.L2(IO_L4N_T0_34)
IO_L1N_T0_AD0N_15: CN7.30 U1.B11(IO_L4N_T0_15)
IO_L1P_T0_34: U1.K3(IO_L4P_T0_34)
IO_L1P_T0_AD0P_15: CN7.32 U1.C11(IO_L4P_T0_15)
IO_L2N_T0_34: U1.L3(IO_L5N_T0_34)
IO_L2N_T0_AD8N_15: CN7.44 U1.A10(IO_L5N_T0_AD9N_15)
IO_L2P_T0_34: U1.L4(IO_L5P_T0_34) U5.16(PB15/SPI2MOSI/UART1TX2)
IO_L2P_T0_AD8P_15: CN7.46 U1.B10(IO_L5P_T0_AD9P_15)
IO_L3N_T0_DQS_34: U1.M5(IO_L6N_T0_VREF_34) U5.11(PB10/UART3TX/I2C2SCL)
IO_L3N_T0_DQS_AD1N_15: CN7.36 U1.C12(IO_L6N_T0_VREF_15)
IO_L3N_T0_DQS_EMCCLK_14: R131.1 U1.M15(IO_L6N_T0_D08_VREF_14)
IO_L3P_T0_DQS_34: U1.L5(IO_L6P_T0_34) U5.12(PB11/UART3RX/I2C2SDA)
IO_L3P_T0_DQS_AD1P_15: CN7.34 U1.D11(IO_L6P_T0_15)
IO_L4N_T0_15: CN7.37 U1.A12(IO_L7N_T1_AD2N_15)
IO_L4N_T0_34: U1.M1(IO_L7N_T1_34) U5.10(PA7/SPI1MOSI)
IO_L4N_T0_D05_14: CN8.3 U1.M17(IO_L7N_T1_D10_14)
IO_L4P_T0_15: CN7.35 U1.B12(IO_L7P_T1_AD2P_15)
IO_L4P_T0_34: U1.M2(IO_L7P_T1_34) U5.15(PB14/SPI2MISO/UART3RTS)
IO_L4P_T0_D04_14: CN8.1 U1.M16(IO_L7P_T1_D09_14)
IO_L5N_T0_34: U1.N6(IO_L8N_T1_34) U5.14(PB13/SPI2SCK/UART3CTS/CAN2TX)
IO_L5N_T0_AD9N_15: CN7.40 U1.A14(IO_L8N_T1_AD10N_15)
IO_L5N_T0_D07_14: U1.N14(IO_L8N_T1_D12_14)
IO_L5P_T0_34: U1.M6(IO_L8P_T1_34) U5.13(PB12/SPI2NSS/CAN2RX)
IO_L5P_T0_AD9P_15: CN7.38 U1.A13(IO_L8P_T1_AD10P_15)
IO_L5P_T0_D06_14: U1.M14(IO_L8P_T1_D11_14)
IO_L6N_T0_D08_VREF_14: U1.N17(IO_L9N_T1_DQS_D13_14)
IO_L6N_T0_VREF_15: CN7.50 U1.B15(IO_L9N_T1_DQS_AD3N_15)
IO_L6N_T0_VREF_34: U1.P1(IO_L9N_T1_DQS_34) U5.7(PA4/SPI1NSS/SPI3NSS1/PA1)
IO_L6P_T0_15: CN7.48 U1.C14(IO_L9P_T1_DQS_AD3P_15)
IO_L6P_T0_34: U1.N1(IO_L9P_T1_DQS_34) U5.9(PA6/SPI1MISO)
IO_L7N_T1_34: CN8.72 U1.N4(IO_L10N_T1_34)
IO_L7N_T1_AD2N_15: CN7.39 U1.A15(IO_L10N_T1_AD11N_15)
IO_L7N_T1_D10_14: CN8.7 U1.P18(IO_L10N_T1_D15_14)
IO_L7P_T1_34: CN8.74 U1.M4(IO_L10P_T1_34)
IO_L7P_T1_AD2P_15: CN7.41 U1.B14(IO_L10P_T1_AD11P_15)
IO_L7P_T1_D09_14: CN8.5 U1.N18(IO_L10P_T1_D14_14)
IO_L8N_T1_34: U1.N2(IO_L11N_T1_SRCC_34)
IO_L8N_T1_AD10N_15: CN7.45 U1.C13(IO_L11N_T1_SRCC_15)
IO_L8N_T1_D12_14: U1.P16(IO_L11N_T1_SRCC_14)
IO_L8P_T1_34: U1.N3(IO_L11P_T1_SRCC_34)
IO_L8P_T1_AD10P_15: CN7.43 U1.D13(IO_L11P_T1_SRCC_15)
IO_L8P_T1_D11_14: U1.P15(IO_L11P_T1_SRCC_14)
IO_L9N_T1_DQS_34: CN8.68 U1.P3(IO_L12N_T1_MRCC_34)
IO_L9N_T1_DQS_AD3N_15: U1.D14(IO_L12N_T1_MRCC_15)
IO_L9N_T1_DQS_D13_14: CN8.2 U1.R15(IO_L12N_T1_MRCC_14)
IO_L9P_T1_DQS_14: CN8.4 U1.P14(IO_L12P_T1_MRCC_14)
IO_L9P_T1_DQS_34: CN8.70 U1.P4(IO_L12P_T1_MRCC_34)
IO_L9P_T1_DQS_AD3P_15: U1.E13(IO_L12P_T1_MRCC_15)
IO_L10N_T1_34: U1.R1(IO_L13N_T2_MRCC_34) U5.4(PC2/UART7TX)
IO_L10N_T1_AD11N_15: CN7.51 U1.D15(IO_L13N_T2_MRCC_15)
IO_L10N_T1_D15_14: CN8.13 U1.T15(IO_L13N_T2_MRCC_14)
IO_L10P_T1_34: U1.R2(IO_L13P_T2_MRCC_34) U5.8(PA5/SPI1SCK)
IO_L10P_T1_AD11P_15: CN7.49 U1.E15(IO_L13P_T2_MRCC_15)
IO_L10P_T1_D14_14: CN8.11 U1.T14(IO_L13P_T2_MRCC_14)
IO_L11N_T1_SRCC_14: CN8.6 U1.R17(IO_L14N_T2_SRCC_14)
IO_L11N_T1_SRCC_15: CN7.54 U1.D16(IO_L14N_T2_SRCC_15)
IO_L11N_T1_SRCC_34: U1.T2(IO_L14N_T2_SRCC_34)
IO_L11P_T1_SRCC_14: CN8.8 U1.R16(IO_L14P_T2_SRCC_14)
IO_L11P_T1_SRCC_15: CN7.52 U1.E16(IO_L14P_T2_SRCC_15)
IO_L11P_T1_SRCC_34: U1.R3(IO_L14P_T2_SRCC_34) U5.5(PC3/UART7RX)
IO_L12N_T1_MRCC_14: U1.T18(IO_L15N_T2_DQS_DOUT_CSO_B_14)
IO_L12N_T1_MRCC_15: CN7.60 U1.A17(IO_L15N_T2_DQS_ADV_B_15)
IO_L12N_T1_MRCC_34: CN8.60 U1.U1(IO_L15N_T2_DQS_34)
IO_L12P_T1_MRCC_14: U1.R18(IO_L15P_T2_DQS_RDWR_B_14)
IO_L12P_T1_MRCC_15: CN7.58 U1.B16(IO_L15P_T2_DQS_15)
IO_L12P_T1_MRCC_34: CN8.58 U1.U2(IO_L15P_T2_DQS_34)
IO_L13N_T2_MRCC_14: CN8.20 U1.U17(IO_L16N_T2_A15_D31_14)
IO_L13N_T2_MRCC_34: CN8.67 U1.V2(IO_L16N_T2_34)
IO_L13P_T2_MRCC_14: CN8.22 U1.T17(IO_L16P_T2_CSI_B_14)
IO_L13P_T2_MRCC_34: CN8.69 U1.V3(IO_L16P_T2_34)
IO_L14N_T2_SRCC_14: CN8.12 U1.U16(IO_L17N_T2_A13_D29_14)
IO_L14N_T2_SRCC_15: CN7.64 U1.D18(IO_L17N_T2_A25_15)
IO_L14N_T2_SRCC_34: CN8.56 U1.T3(IO_L17N_T2_34)
IO_L14P_T2_SRCC_14: CN8.14 U1.U15(IO_L17P_T2_A14_D30_14)
IO_L14P_T2_SRCC_15: CN7.62 U1.E17(IO_L17P_T2_A26_15)
IO_L14P_T2_SRCC_34: CN8.54 U1.T4(IO_L17P_T2_34)
IO_L15N_T2_DQS_34: CN8.62 U1.V4(IO_L18N_T2_34)
IO_L15N_T2_DQS_ADV_B_15: CN7.55 U1.C18(IO_L18N_T2_A23_15)
IO_L15N_T2_DQS_DOUT_CSO_B_14: CN8.17 U1.V17(IO_L18N_T2_A11_D27_14)
IO_L15P_T2_DQS_15: CN7.53 U1.C17(IO_L18P_T2_A24_15)
IO_L15P_T2_DQS_34: CN8.64 U1.U4(IO_L18P_T2_34)
IO_L15P_T2_DQS_RDWR_B_14: CN8.15 U1.V16(IO_L18P_T2_A12_D28_14)
IO_L16N_T2_34: CN8.63 U1.P5(IO_L19N_T3_VREF_34)
IO_L16N_T2_A15_D31_14: CN8.21 U1.T13(IO_L19N_T3_A09_D25_VREF_14)
IO_L16N_T2_A27_15: CN7.66 U1.F18(IO_L19N_T3_A21_VREF_15)
IO_L16P_T2_34: CN8.61 U1.P6(IO_L19P_T3_34)
IO_L16P_T2_A28_15: CN7.68 U1.G17(IO_L19P_T3_A22_15)
IO_L16P_T2_CSI_B_14: CN8.19 U1.R13(IO_L19P_T3_A10_D26_14)
IO_L17N_T2_34: CN8.50 U1.U5(IO_L20N_T3_34)
IO_L17N_T2_A13_D29_14: CN8.16 U1.V14(IO_L20N_T3_A07_D23_14)
IO_L17N_T2_A25_15: CN7.63 U1.G16(IO_L20N_T3_A19_15)
IO_L17P_T2_34: CN8.48 U1.U6(IO_L20P_T3_34)
IO_L17P_T2_A14_D30_14: CN8.18 U1.U14(IO_L20P_T3_A08_D24_14)
IO_L17P_T2_A26_15: CN7.65 U1.H16(IO_L20P_T3_A20_15)
IO_L18N_T2_34: CN8.57 U1.T5(IO_L21N_T3_DQS_34)
IO_L18N_T2_A11_D27_14: CN8.25 U1.V13(IO_L21N_T3_DQS_A06_D22_14)
IO_L18N_T2_A23_15: CN7.57 U1.F15(IO_L21N_T3_DQS_A18_15)
IO_L18P_T2_34: CN8.59 U1.R5(IO_L21P_T3_DQS_34)
IO_L18P_T2_A12_D28_14: CN8.27 U1.V12(IO_L21P_T3_DQS_14)
IO_L18P_T2_A24_15: CN7.59 U1.G15(IO_L21P_T3_DQS_15)
IO_L19N_T3_A09_D25_VREF_14: CN8.28 U1.U12(IO_L22N_T3_A04_D20_14)
IO_L19N_T3_A21_VREF_15: CN7.71 U1.F14(IO_L22N_T3_A16_15)
IO_L19N_T3_VREF_34: R140.2 U1.T7(IO_L22N_T3_34)
IO_L19P_T3_34: U1.R7(IO_L22P_T3_34)
IO_L19P_T3_A10_D26_14: CN8.26 U1.T12(IO_L22P_T3_A05_D21_14)
IO_L19P_T3_A22_15: CN7.73 U1.G14(IO_L22P_T3_A17_15)
IO_L20N_T3_34: CN8.55 U1.V6(IO_L23N_T3_34)
IO_L20N_T3_A07_D23_14: CN8.31 U1.V11(IO_L23N_T3_A02_D18_14)
IO_L20N_T3_A19_15: CN7.72 U1.H18(IO_L23N_T3_FWE_B_15)
IO_L20P_T3_34: CN8.53 U1.U7(IO_L23P_T3_34)
IO_L20P_T3_A08_D24_14: CN8.29 U1.U11(IO_L23P_T3_A03_D19_14)
IO_L20P_T3_A20_15: CN7.74 U1.H17(IO_L23P_T3_FOE_B_15)
IO_L21N_T3_DQS_34: CN8.44 U1.V7(IO_L24N_T3_34)
IO_L21N_T3_DQS_A06_D22_14: CN8.33 U1.V9(IO_L24N_T3_A00_D16_14)
IO_L21N_T3_DQS_A18_15: U1.E18(IO_L24N_T3_RS0_15)
IO_L21P_T3_DQS_14: CN8.35 U1.U9(IO_L24P_T3_A01_D17_14)
IO_L21P_T3_DQS_15: R96.2 U1.F17(IO_L24P_T3_RS1_15)
IO_L21P_T3_DQS_34: CN8.46 U1.V8(IO_L24P_T3_34)
IO_L22N_T3_34: CN8.40
IO_L22P_T3_34: CN8.42 U1.R6(IO_25_34)
IO_L22P_T3_A05_D21_14: U1.U10(IO_25_14)
IO_L22P_T3_A17_15: U1.H14(IO_25_15)
IO_L23N_T3_34: CN8.49
IO_L23N_T3_A02_D18_14: CN8.32
IO_L23N_T3_FWE_B_15: CN7.79
IO_L23P_T3_34: CN8.47
IO_L23P_T3_A03_D19_14: CN8.30
IO_L23P_T3_FOE_B_15: CN7.77
IO_L24N_T3_34: CN8.45
IO_L24N_T3_A00_D16_14: CN8.39
IO_L24N_T3_RS0_15: CN7.67
IO_L24P_T3_34: CN8.43
IO_L24P_T3_A01_D17_14: CN8.41
IO_L24P_T3_RS1_15: CN7.69
JTAG_TCK: R137.1 U5.23(PC10/UART4TX/SPI3SCK1/SD_D2)
JTAG_TDI: R136.1 U5.25(PC12/UART5TX/SPI3MOSI1/SD_CK)
JTAG_TDO: R138.1 U5.24(PC11/UART4RX/SPI3MISO1/SD_D3)
JTAG_TMS: R135.1 U5.26(PD2/UART5RX/SD_CMD)
JTAG_VREF: D9.1(C) R134.2 U16.3
MCU_IO0: R139.1 U5.17(PC8/SD_D0)
MCU_IO1: R89.2 R140.1 U5.18(PA8/UART1RX2/PC9/SD_D1)
MCU_SWCLK: D10.2(IN) D10.5(NC) U5.22(PA14/SWCLK/UART3RX2) U16.2
MCU_SWDIO: D10.1(IN) D10.6(NC) U5.19(PA13/SWDIO/UART3TX2) U16.1
MCU_XI: C204.2 U5.1(OSC_IN/PD0) X2.3
MCU_XO: C205.2 U5.2(OSC_OUT/PD1) X2.1
MGT_CLK0_N: C15.2 U1.A4(MGTPRXP1_216)
MGT_CLK0_P: C14.2 U1.E3(MGTPRXN0_216)
MGT_CLK1_N: C13.2 U1.C4(MGTPRXP2_216)
MGT_CLK1_P: C12.2 U1.A3(MGTPRXN1_216)
MGT_EXTCLK0_N: C15.1 CN7.29 R133.2
MGT_EXTCLK0_P: C14.1 CN7.31 R133.1
MGT_RX0_N: U1.G3(MGTPRXN3_216)
MGT_RX0_P: CBB2.(GND) U1.B1(MGTPTXN3_216) U1.G4(MGTPRXP3_216)
MGT_RX1_N: CN7.23 U1.B4(MGTAVCC)
MGT_RX1_P: CN7.25
MGT_RX2_N: CN7.18 U1.E5(MGTAVCC)
MGT_RX2_P: CN7.20 U1.C5(MGTAVCC)
MGT_RX3_N: CN7.24
MGT_RX3_P: CN7.26 U1.F5(MGTAVCC)
MGT_TX0_P: U1.B2(MGTPTXP3_216)
MGT_TX1_N: CN7.12 U1.A2(MGTAVTT)
MGT_TX1_P: CN7.14
MGT_TX2_N: CN7.11 U1.E1(MGTAVTT)
MGT_TX2_P: CN7.13 U1.C1(MGTAVTT)
MGT_TX3_N: CN7.19 U1.G2(MGTAVTT)
MGT_TX3_P: CN7.17 U1.F3(MGTAVTT)
MGTAVCC_1V0: C2.2 C4.2 C5.2 C175.2 FB8.2
MGTAVTT_1V2: C3.2 C6.2 C7.2 C176.2 R1.2 U4.1(OUT) U4.2(NC)
OSC_50M: OSC3.3(OUT) R91.1
PROGRAM_B: CN8.36 R29.1 U1.F13(M2_0)
$1N9867: LED2.2(A) R26.1
$6N1068: OSC3.1(Tri-sta) R92.2
$9N704: F1.2 FB7.1
$10N273: LED4.2(A) R97.2
$10N513: D7.1(C) R96.1 SW6.1
$10N1466: LED5.2(A) R131.2
$12N5394: D8.1(C) R89.1 SW7.1
$12N5519: LED6.2(A) R139.2
Net-(C170-2): C170.2 CBB1.8(EN2) CBB1.9(EN3) CBB1.10(EN4) R112.2
Net-(CBB1-7): CBB1.7(EN1) R111.2
Net-(R1-1): R1.1 U1.H1(MGTPTXN0_216)

Not connected (* = marked no-connect by the designer): CN7 5* 6* 7* 8*; OSC1 1(OE)* 2(NC)*; SW6 2*; SW7 2*; U1 A1(GND) A5(GND) A6(MGTRREF_216) A7(GND) A8(GND) A11(GND) A16(VCCO_15) A18(GND) B5(MGTREFCLK1N_216) B6(MGTREFCLK1P_216) B9(IO_L3P_T0_DQS_AD1P_15) B13(VCCO_15) B17(IO_L16N_T2_A27_15) C3(MGTPRXN2_216) C8(IO_L1N_T0_AD0N_15) C9(IO_L2N_T0_AD8N_15) C10(VCCO_15) D1(MGTPTXN2_216) D2(MGTPTXP2_216) D5(MGTREFCLK0N_216) D6(MGTREFCLK0P_216) D8(IO_L1P_T0_AD0P_15) D9(IO_L2P_T0_AD8P_15) D10(IO_0_15) D17(VCCO_15) E4(MGTPRXP0_216) E10(VCCO_0) E12(CFGBVS_0) E14(VCCO_15) F1(MGTPTXN1_216) F2(MGTPTXP1_216) F7(VCCINT) F8(TCK_0) F9(VCCINT) G8(VCCINT) G12(VCCAUX) G18(VCCO_15) H2(MGTPTXP0_216) H7(VCCINT) H9(VCCINT) H13(VCCAUX) J4(IO_L2N_T0_34) J5(IO_L2P_T0_34) J6(IO_0_34) J8(VCCINT) J9(GNDADC_0) J10(VCCADC_0) J15(IO_L2P_T0_D02_14) J16(IO_L2N_T0_D03_14) J18(IO_L3P_T0_DQS_PUDC_B_14) K2(IO_L3P_T0_DQS_34) K5(IO_L1N_T0_34) K6(IO_L1P_T0_34) K9(VREFN_0) K13(VCCAUX) K16(IO_L1P_T0_D00_MOSI_14) L6(VCCO_34) L10(VREFP_0) L14(IO_0_14) L17(IO_L1N_T0_D01_DIN_14) M3(VCCO_34) M9(DXN_0) M13(VCCAUX) P7(VCCO_34) P13(VCCAUX) P17(VCCO_14) R4(VCCO_34) R8(TMS_0) R14(VCCO_14) T1(VCCO_34) T8(TDO_0) T9(TDI_0) T11(VCCO_14) T16(GND) U3(GND) U8(VCCO_14) U13(GND) U18(VCCO_14) V1(GND) V5(VCCO_34) V10(GND) V15(VCCO_14) V18(GND)

## Notes on the sheets
sheet 1
- FPGA 配置
- ④
- TDI串阻靠近FPGA,其他JTAG信号串阻靠近JTAG接口
- 1、DXP/N:接入热敏温度二极管
  (Anode: DXP; Cathode:DXN)
  -- UG475
  这里不使用,接地
- BANK电压
- 2、VREFP/N:接入1.25V VREF;
  用于12Bit 1Msps ADC
  或者全部接地使用内部VREF；--UG475 UG480
  这里使用内部
- 注意，地分割不是必须的，
  这里原理图上好看单独标注，
  布局分离即可
- ⑤
- 注意，这里使用了SPI FLASH,
  需要BANK14和BANK0 IO电压一致
- 3、VP/N_0:专用ADC差分输入；
  单端下:电压范围0-1V;VN_0可承受范围0-0.5V;
  双极性信号:依然是1V，
  软件配置需要修改为双极性，共模电压说明看手册
  如果不用，接地 --UG480
- 注释：温度传感器也在ADC通道上，
   见UG480 Page 24Temperature Sensor
- DONE 指示灯
- 4、ADC供电为1.8V，
  磁珠滤波即可，
  此脚必须供电
- 7系产品FPGA的DONE信号内置了大约10K的上拉信号，
  因此外部上拉不是必须的。
- ①
- 5、CFGBVS_0:
  如果BANK 0、14或15的VCCO为2.5V/3.3V，则必须连接到VCCO_0;
  如果BANK 0、14和15的VCCO小于或等于1.8V，则应连接到GND。
  对于BANK0,CFGBVS一直有效，
  对于BANK14、15，只在配置阶段有效，
  具体参考UG470 ^Configuration Banks Voltage Select^
  这里BANK14\15用3.3VBANK0使用3.3V，因此直接连接到3.3V
- VCCO引脚电容说明见UG483 ：
  Required PCB Capacitor Quantities per Device
- VCCO_0 根据需要可以用1.8V的，
  但是与之对应，CFGBVS状态需要改变
- ②
- 6、PROGRAM_B：低电平复位配置并重新进入配置；
  这里不考虑外部配置，直接使用不低于4.7KΩ的电阻上拉
- FPGA_DONE加载之前为低电平，加载前亮灯，加载后灯灭
- INIT_B：配置完成变成高电平，
  也可以用于外部拉低保持不配置状态直到拉高；
  这里不考虑外部配置，直接使用不低于4.7KΩ的电阻上拉
- 对于PROGRAM_B和INIT_B,参考UG470 Serial Configuration Mode
- 配置过程中IO状态
- 配置模式
- Config部分参考UG470,XMP277
- PUDC可以直连，推荐小于1K
- 配置模式引脚有内置上拉，默认是111
- ③
- PUDC高电平为配置中禁用IO内部上拉电阻；
  低电平则启用配置过程中IO内部上拉
  焊盘控制选焊
- 001: MasterSPI
- 用不用这个adc呢
- 可以直接接地，用电阻要小于1K
- JTAG only:101(不使用)
  Master SPI: 00 1
  Slave Serial:11 1
  Slave SelectMAP:11 0（不使用）
- ⑥
- 配置信号
- 考虑替换为W25Q128JVPIM，W25Q128JVPIQ W25Q64JVPIQ
- CONFIG FLASH
- 这里使用3.3V FLASH是因为BANK14是用的3.3V
  实际上BANK14和BANK0电压要一样
- 推荐4.7K以下，这里懒得改
- 考虑修改封装
- 按照官方参考设计，这里用2.4K上拉FCS,4.7K上拉D02/D03
- JV型号最低工作电压2.7V
sheet 2
- 注意，这里使用了SPI FLASH
  需要BANK14和BANK0 IO电压一致
sheet 3
- 1.8V手册需求：47uF+4.7uF*2+0.47uF*3
- 1V手册需求：100uF+4.7uF*2+0.47uF*3
- BRAM 1.0V手册需求：47uF+4.7uF*1+0.47uF*1
sheet 4
- 如果GTP完全不用，MGTRREF应该接地
- 100ohm终端电阻
- 参考设计时钟为125MHz
- 这是参考设计用的差分对
- USBC
- TX/RX只能配对使用
- 这是参考设计用的差分对
- -1速度等级的 GTP只有3.75Gb/s 参考DS181
- MGTVCC 4通道用满 0.161 A
  MGTVTT 4通道用满 0.197 A  (-2速率 5Gp/s)
  MGTVCC 2通道用满 0.096 A
  MGTVTT 2通道用满 0.102 A(-2速率 6Gp/s)
  MGTVCC 1通道用满 0.055 A
  MGTVTT 1通道用满 0.040 A (-2速率 6Gp/s)
  实际这里-1 3.75Gp/s 1通道：
  MGTVCC 1通道用满 0.044 A
  MGTVTT 1通道用满 0.038 A
- MGTAVCC和MGTAVTT是模拟供电，噪声不要太大，手册要求不超过10mVpp
- 手册推荐4.7uF+0.1uF*2来设计
sheet 5
- USB3和2都是差分90R
- 手册单Pin载流0.5A，我觉得可以走1A
- 提供20对差分对
- https://xillybus.com/sfp2usb-module 明确指出这个IP符合USB3规范支持极性翻转（这里没使用）
- 外部加载信号
- FPGA->外部
- 信号不经过连接器，TX耦合电容靠近接收侧或者发送侧都行，
  经过过连接器最好靠近TX侧，另外原则上来说
  这里switch发送耦合电容应该在开关之前放置两对，
  不过实测放在开关之后放置一对也行，
  但是考虑对端接收端可能存在的抽象共模，还是应该放在switch前面
- 外部->FPGA
- init_b只是指示上升之后mode引脚采样，不用引出
- 要从并加载，至少d7-d0要引出
- 要从串加载，D01（DIN）引出即可
- 根据接触电阻保守估算，按照每个Pin温升10℃可过电流0.689A
- 提供30对差分对
sheet 6
- AC701用的是SI5324,太贵了：
- 2.5V-3.3V供电
- 156.25MHz
- 这个电阻不需要，内部有
- 这一路从底板引入
- 因为接到了BANK15上所以按照BANK15的来
- 这个使能引脚一般留空就可以
- 宽电压范围1.8V-3.3V
sheet 7
- XC7K35T_GTP_USB_Core_LiteRevB.1
- 1、在RevB上小改动，完善
- 版本说明：这一版是无DDR版
sheet 8
- 布线的时候直连过去就行
- ESD
- 注意，SWD电压为VCCO34,
  这里默认是3.3V可以直接用，但是如果修改了需要对应改变
- 注意，这个电压为BANK0电压
sheet 9
- 需要的时候可以修改3.3V和2.5V的配置电阻来互换
- B0 B14 B34绑在VCC3V上，B15绑在VCC2V5上
- FPGA上电时序：1V，1.8V , VCCO
- GTP上电时序：1V（两个1V不分先后），1.2V
- WSON6热阻： 92.5
- X2SON热阻：218.6
sheet 10
- 板载用户LED
- U10
- 板载用户LED
- PL灯
- 板载用户按键
- MIO按键
- 板载用户按键
sheet 11
- 保持和连接的BANK一致
- 板载用户LED
